# EAGLE board 2017_01_15_release_v2 (EAGLE 7.6.0), part 1 of 2
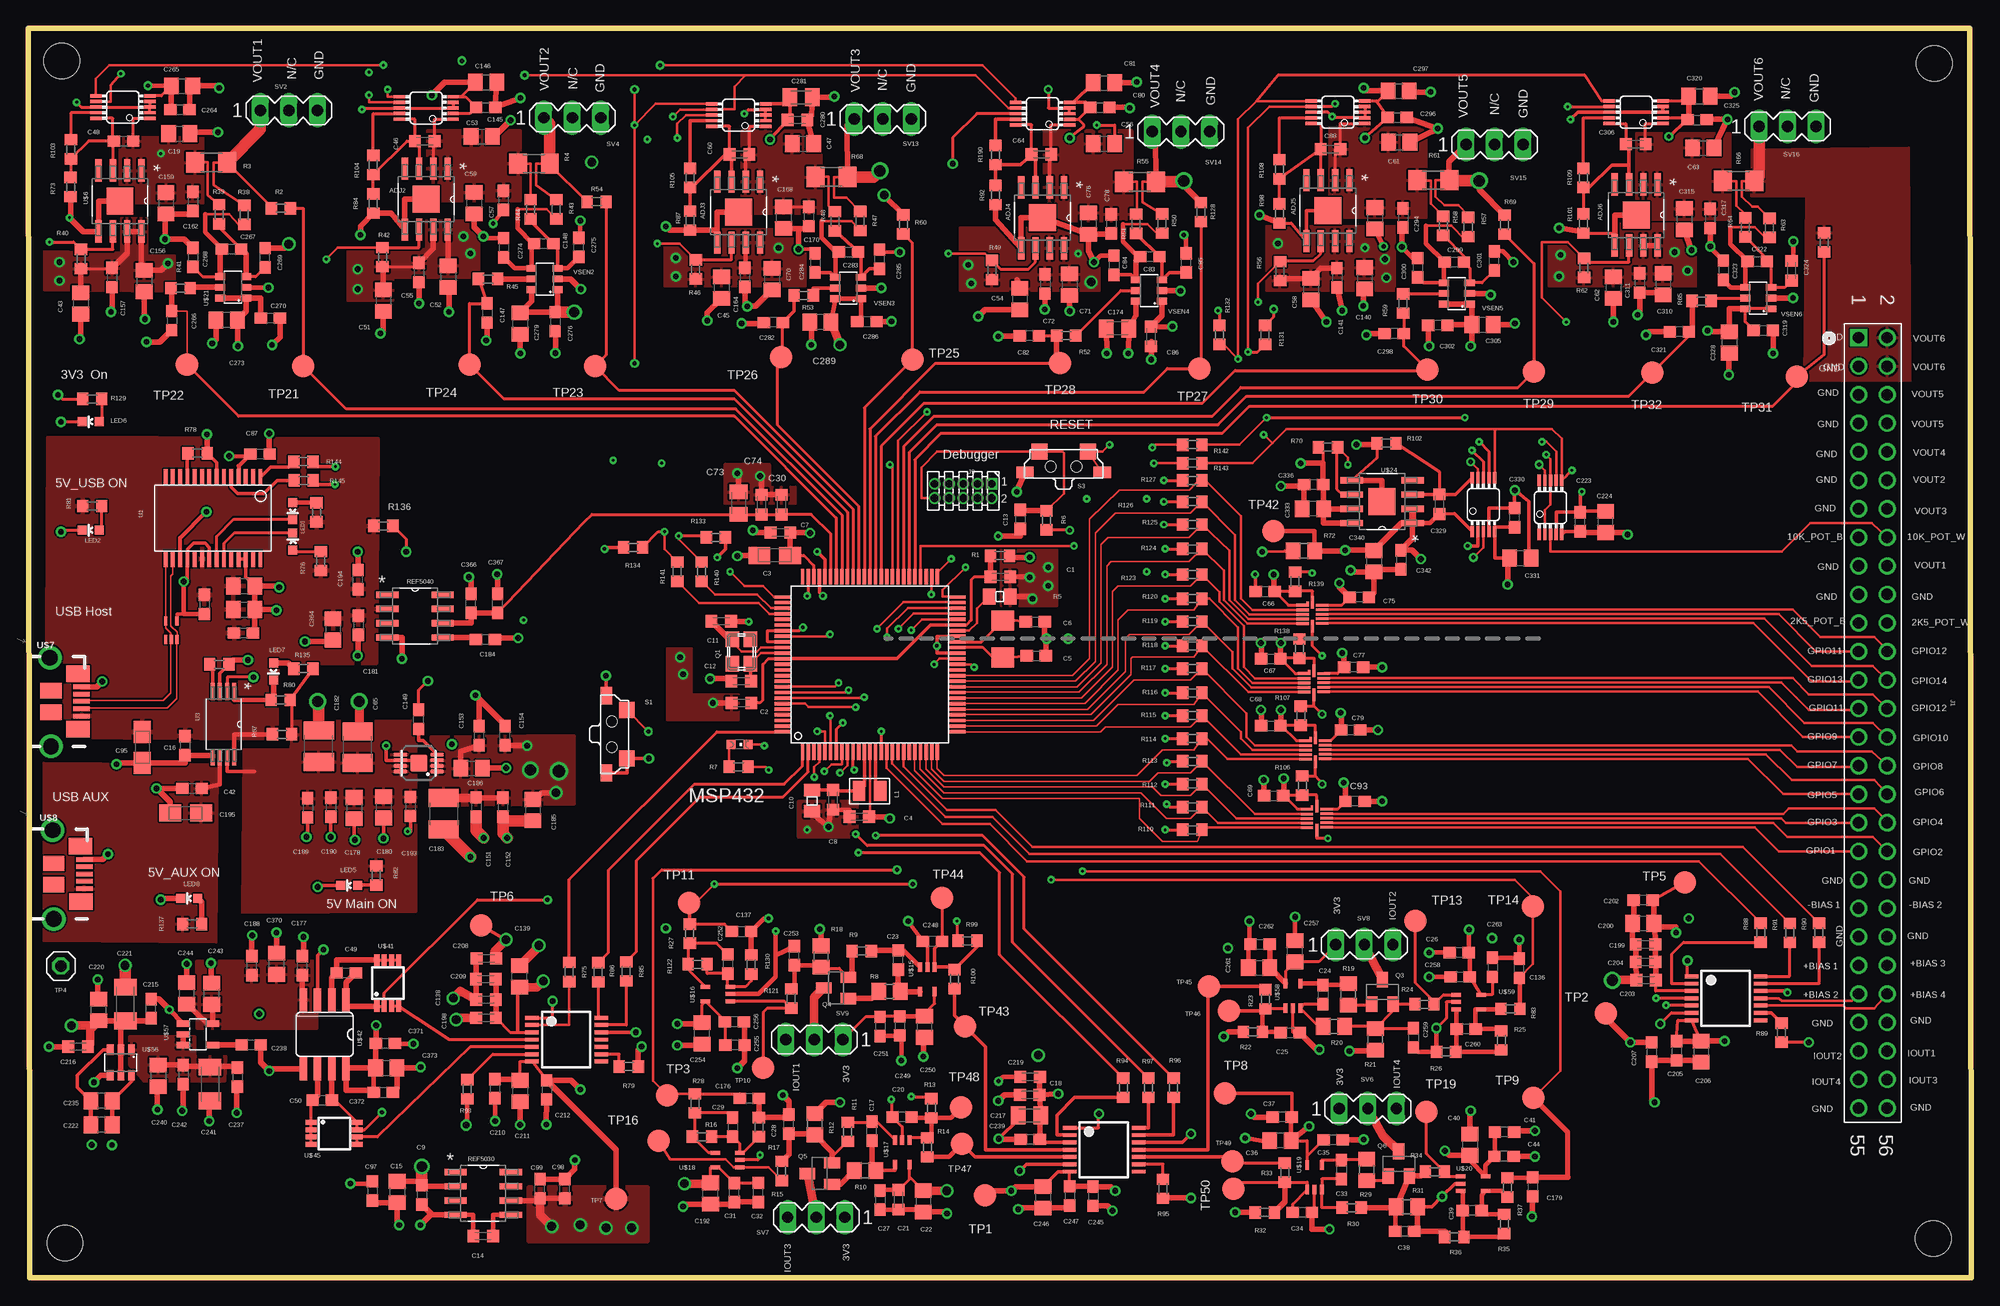
[diagram p21: board, top side]
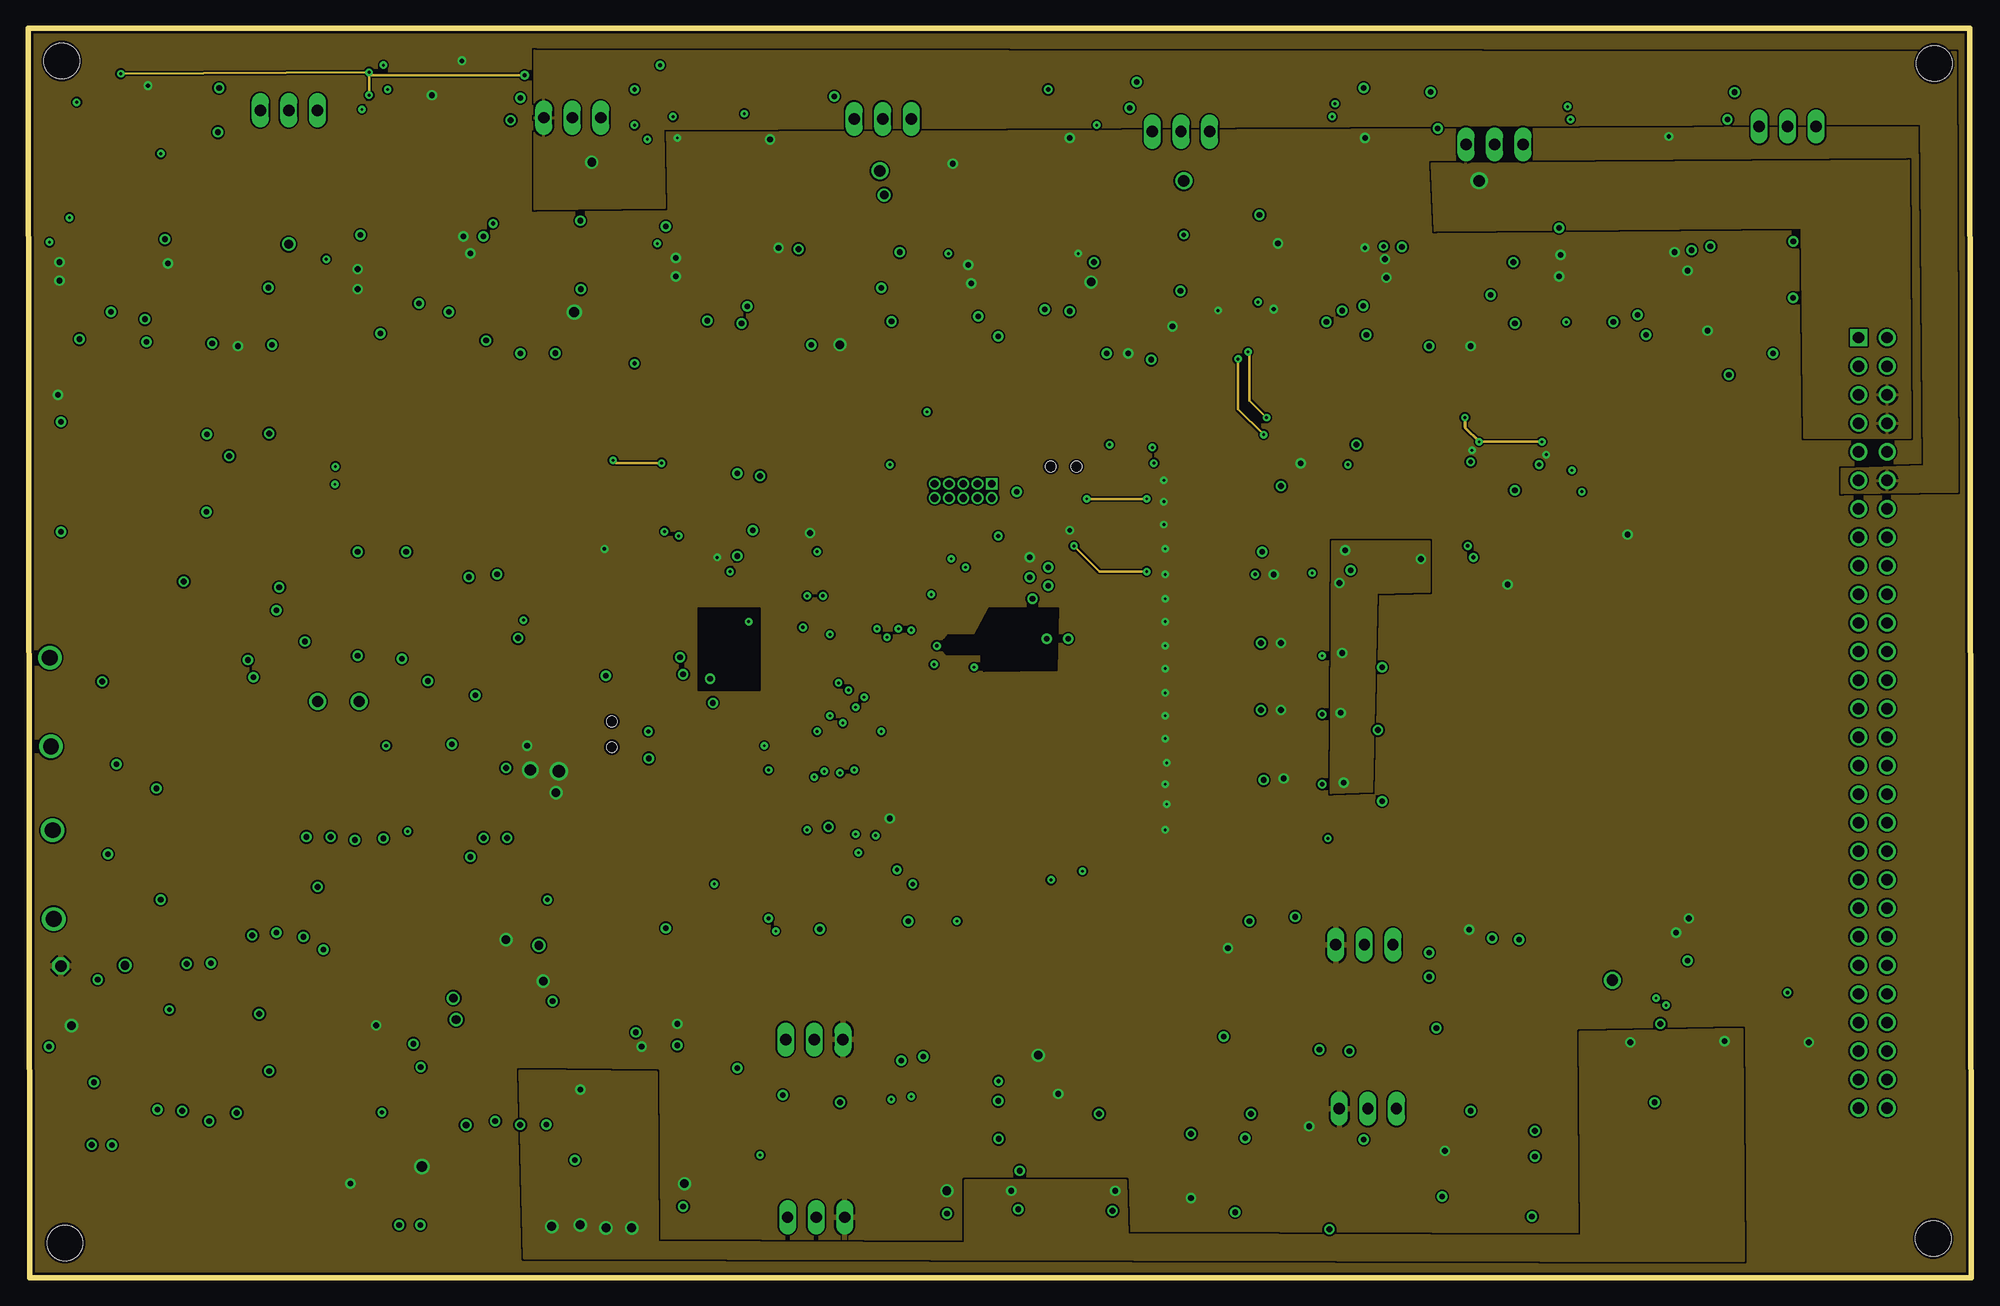
[diagram p22: board, inner layer Mid-Top]
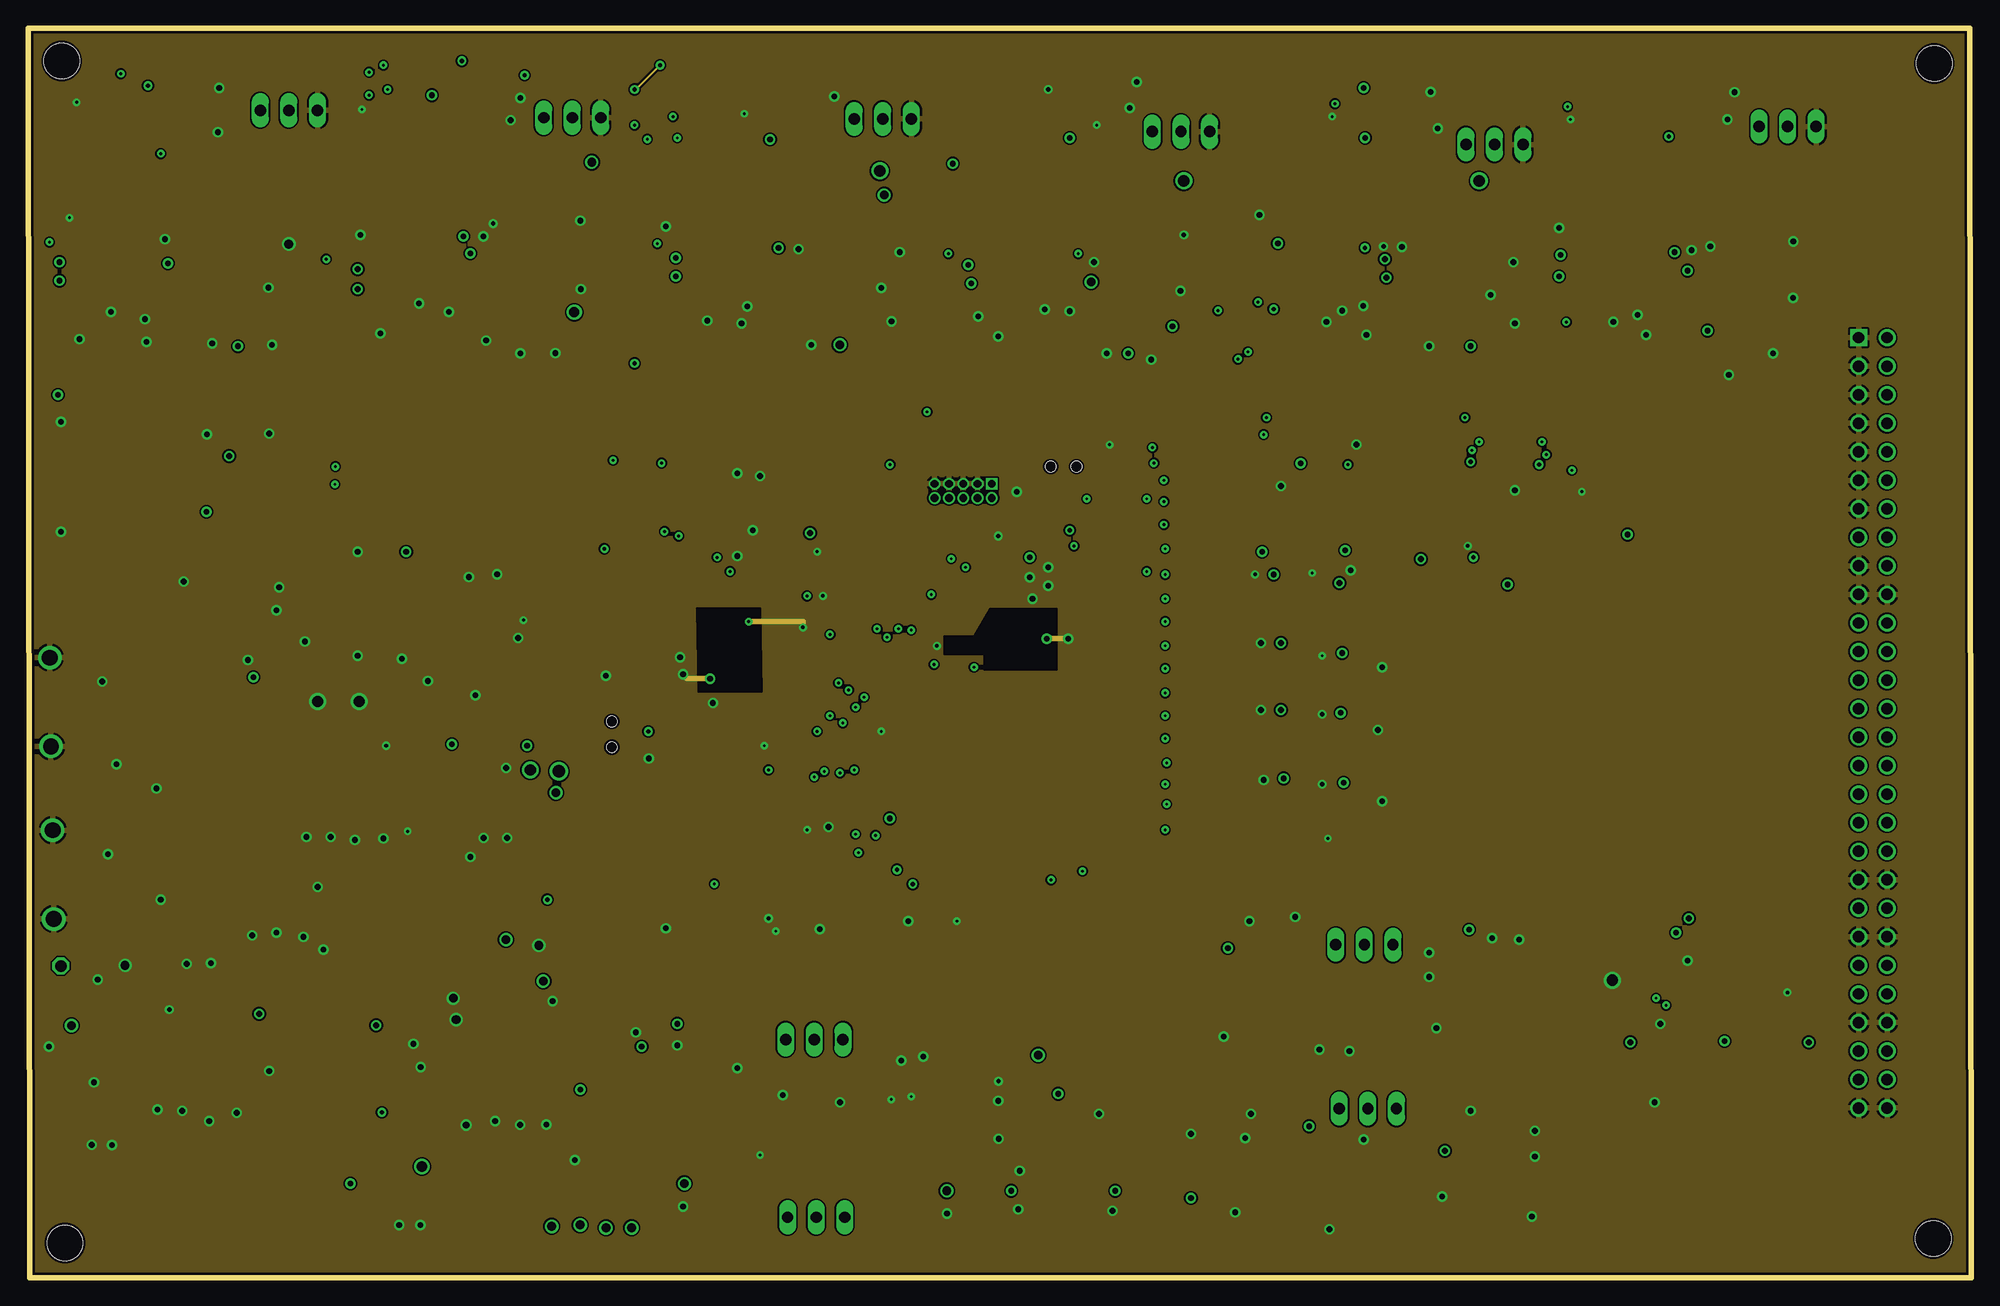
[diagram p23: board, inner layer Mid-Bottom]
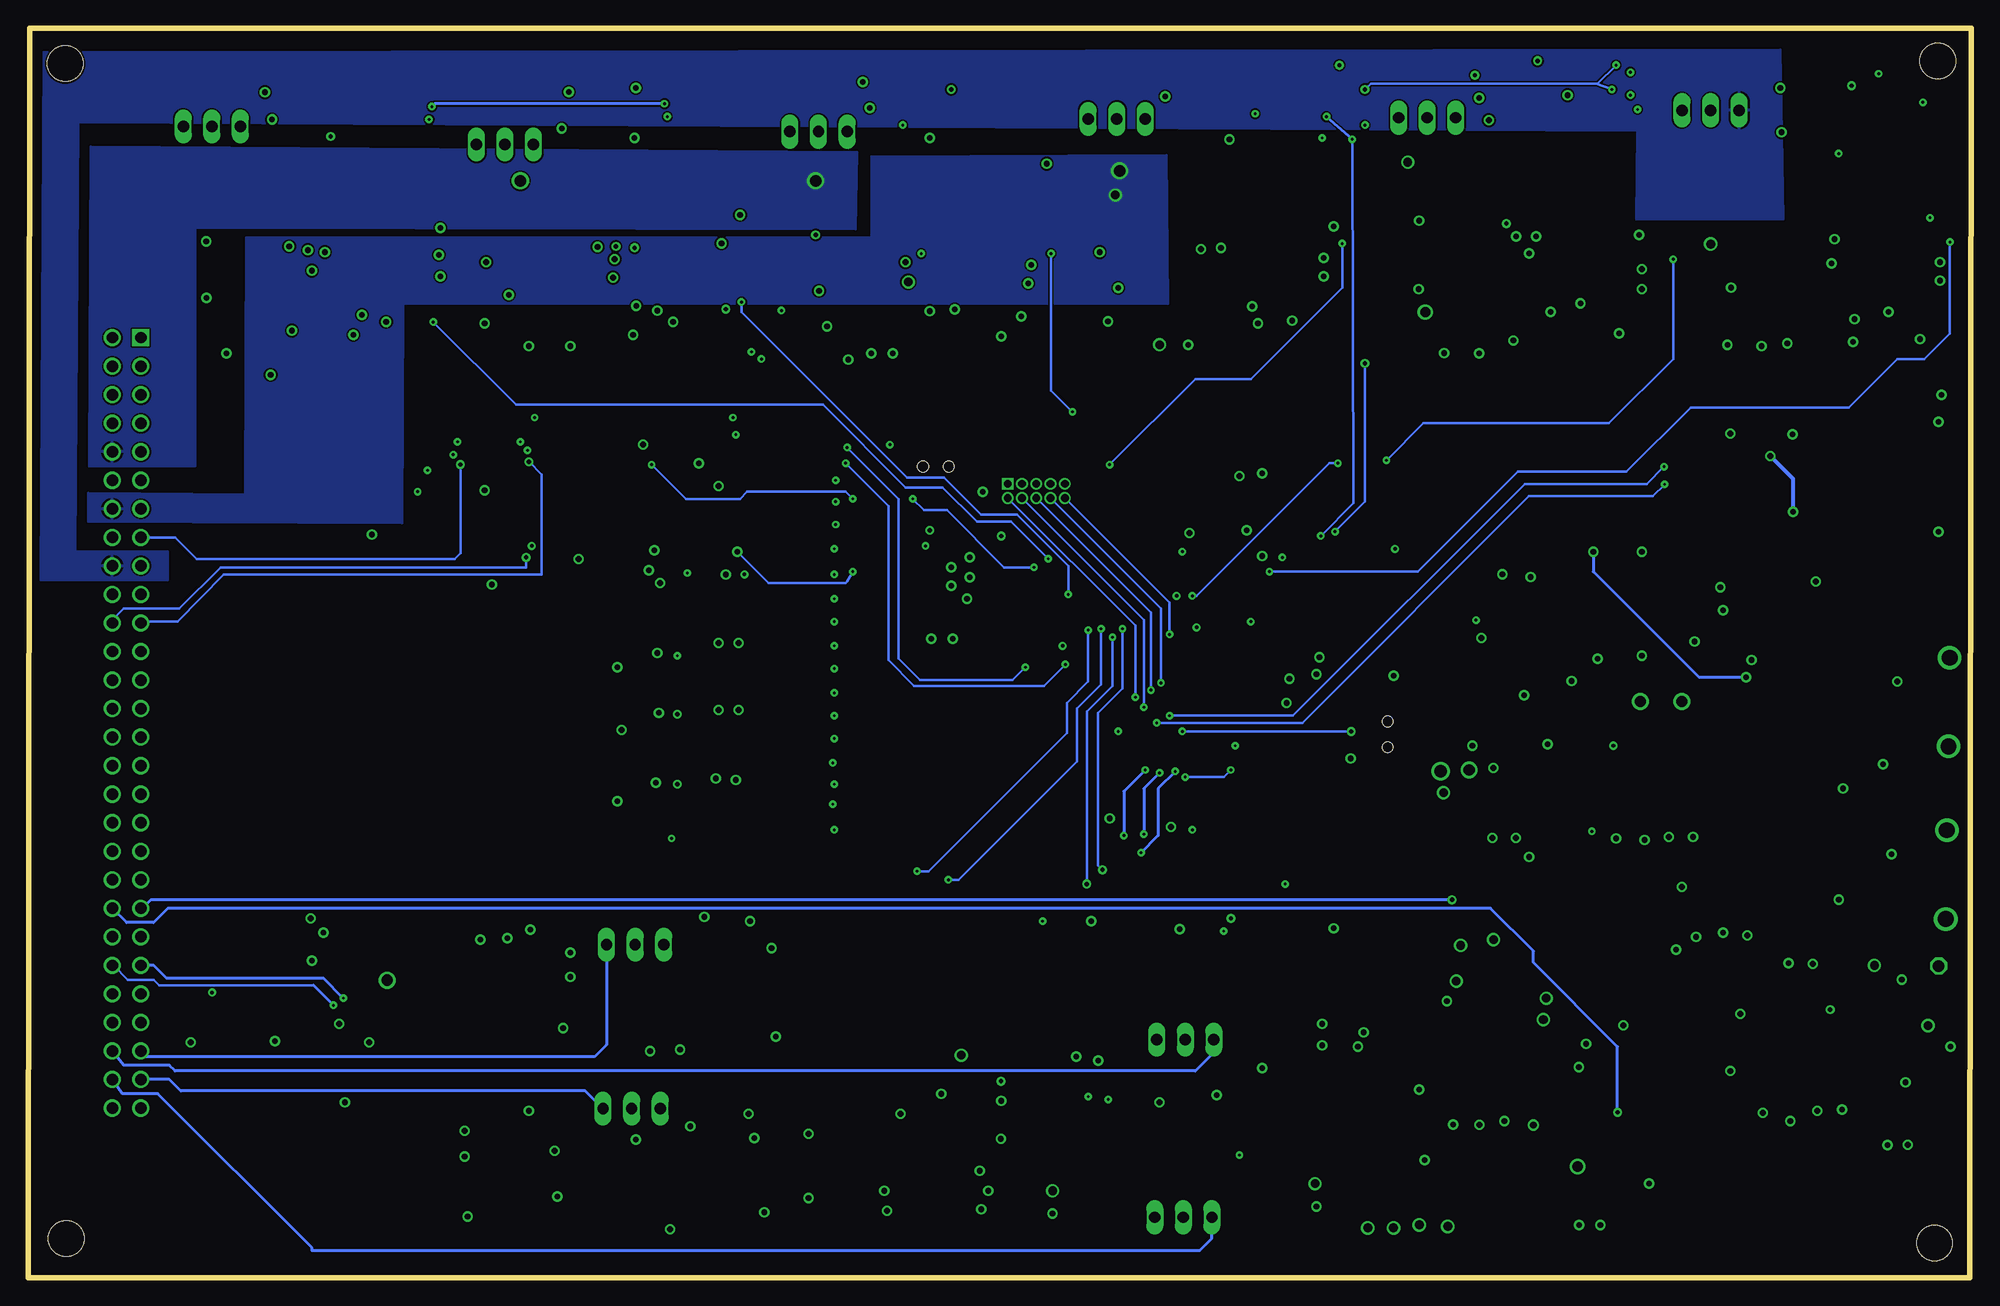
[diagram p24: board, bottom side, seen from below]

Size 172.97 x 111.25 mm. Coordinates in mm from the lower left corner, seen from the top.
Outline: 0.13,0 172.97,0 172.85,111.25 0,111.25 0.13,0
Copper layers (1+2*15+16): Top 0.0178mm / dielectric 12mil / Mid-Top 0.0356mm / dielectric 27mil / Mid-Bottom 0.0356mm / dielectric 12mil / Bottom 0.0178mm
Design rules "MSP430 PCBExpress 4-layer-dietmar_Eddy": minimum track width 6mil, minimum drill 10mil, track to track 6mil, track to pad 6mil, pad to pad 6mil, via to via 8mil, smd to smd 6mil, copper to edge 8mil, drill to drill 8mil, minimum pad ring 0mil, minimum via ring 8mil, stop-mask expansion 5mil, vias tented up to drill 15mil, thermal gap 8mil
Net classes: 0 default: width 0.152 mm, drill 0.254 mm, clearance 0.152 mm; 1 GND: width 0.152 mm, drill 0.254 mm, clearance 0.152 mm to class 0, clearance 0.152 mm; 2 Power: width 0.152 mm, drill 0.254 mm, clearance 0.152 mm to class 0, clearance 0.152 mm to class 1, clearance 0.152 mm

## Footprints (pad centres in the part's own frame; a part is rotated, then mirrored left to right if it is on the bottom)
FC-135_32KHZ = smd 1.8 x 2: P$1 -1.74,0.1; P$2 1.56,0.1
SOIC_8N_PAD = smd 1.981 x 0.559: 1 -2.714,1.905; 2 -2.714,0.635; 3 -2.714,-0.635; 4 -2.714,-1.905; 5 2.714,-1.905; 6 2.714,-0.635; 7 2.714,0.635; 8 2.714,1.905 | smd 2.4 x 2.4: 9 0,0
C0603K = smd 1.05 x 1.08: 1 -0.875,0; 2 0.875,0
A/3216-18R = smd 1.95 x 1.5: + 1.375,0; - -1.375,0
C0603 = smd 1.1 x 1: 1 -0.85,0; 2 0.85,0
CSMD0805 = smd 1.092 x 1.397: 1 -0.94,0; 2 0.94,0
C0805 = smd 1.3 x 1.5: 1 -0.95,0; 2 0.95,0
C1210 = smd 1.6 x 2.7: 1 -1.4,0; 2 1.4,0
C0805K = smd 1.3 x 1.6: 1 -1,0; 2 1,0
C1206K = smd 1.5 x 2: 1 -1.5,0; 2 1.5,0
SOT_DRL_N5 = smd 0.3 x 0.8: 1 -0.5,-0.8; 2 0,-0.8; 3 0.5,-0.8; 4 0.5,0.85; 5 -0.5,0.85
SAMTEC_TSW-128-07-L-D = drill 1.016 square: 1 -68.58,-2.54 | drill 1.016: 2 -68.58,0; 3 -66.04,-2.54; 4 -66.04,0; 5 -63.5,-2.54; 6 -63.5,0; 7 -60.96,-2.54; 8 -60.96,0; 9 -58.42,-2.54; 10 -58.42,0; 11 -55.88,-2.54; 12 -55.88,0; 13 -53.34,-2.54; 14 -53.34,0; 15 -50.8,-2.54; 16 -50.8,0; 17 -48.26,-2.54; 18 -48.26,0; 19 -45.72,-2.54; 20 -45.72,0; 21 -43.18,-2.54; 22 -43.18,0; 23 -40.64,-2.54; 24 -40.64,0; 25 -38.1,-2.54; 26 -38.1,0; 27 -35.56,-2.54; 28 -35.56,0; 29 -33.02,-2.54; 30 -33.02,0; 31 -30.48,-2.54; 32 -30.48,0; 33 -27.94,-2.54; 34 -27.94,0; 35 -25.4,-2.54; 36 -25.4,0; 37 -22.86,-2.54; 38 -22.86,0; 39 -20.32,-2.54; 40 -20.32,0; 41 -17.78,-2.54; 42 -17.78,0; 43 -15.24,-2.54; 44 -15.24,0; 45 -12.7,-2.54; 46 -12.7,0; 47 -10.16,-2.54; 48 -10.16,0; 49 -7.62,-2.54; 50 -7.62,0; 51 -5.08,-2.54; 52 -5.08,0; 53 -2.54,-2.54; 54 -2.54,0; 55 0,-2.54; 56 0,0
ARM-10 = drill 0.7 pad 0.95 square: 1 -2.54,-0.635 | drill 0.7 pad 0.95: 2 -2.54,0.635; 3 -1.27,-0.635; 4 -1.27,0.635; 5 0,-0.635; 6 0,0.635; 7 1.27,-0.635; 8 1.27,0.635; 9 2.54,-0.635; 10 2.54,0.635
0806 = smd 1.1 x 1.8: 1 -0.94,0; 2 0.94,0
CHIPLED_0603 = smd 0.8 x 0.8: A 0,-0.75; C 0,0.75
LED-0603 = smd 0.8 x 0.8: A 0,-0.75; C 0,0.75
LQFP100 = smd 1.4 x 0.3: 1 -7.8,6; 2 -7.8,5.5; 3 -7.8,5; 4 -7.8,4.5; 5 -7.8,4; 6 -7.8,3.5; 7 -7.8,3; 8 -7.8,2.5; 9 -7.8,2; 10 -7.8,1.5; 11 -7.8,1; 12 -7.8,0.5; 13 -7.8,0; 14 -7.8,-0.5; 15 -7.8,-1; 16 -7.8,-1.5; 17 -7.8,-2; 18 -7.8,-2.5; 19 -7.8,-3; 20 -7.8,-3.5; 21 -7.8,-4; 22 -7.8,-4.5; 23 -7.8,-5; 24 -7.8,-5.5; 25 -7.8,-6; 51 7.8,-6; 52 7.8,-5.5; 53 7.8,-5; 54 7.8,-4.5; 55 7.8,-4; 56 7.8,-3.5; 57 7.8,-3; 58 7.8,-2.5; 59 7.8,-2; 60 7.8,-1.5; 61 7.8,-1; 62 7.8,-0.5; 63 7.8,0; 64 7.8,0.5; 65 7.8,1; 66 7.8,1.5; 67 7.8,2; 68 7.8,2.5; 69 7.8,3; 70 7.8,3.5; 71 7.8,4; 72 7.8,4.5; 73 7.8,5; 74 7.8,5.5; 75 7.8,6 | smd 0.3 x 1.4: 26 -6,-7.8; 27 -5.5,-7.8; 28 -5,-7.8; 29 -4.5,-7.8; 30 -4,-7.8; 31 -3.5,-7.8; 32 -3,-7.8; 33 -2.5,-7.8; 34 -2,-7.8; 35 -1.5,-7.8; 36 -1,-7.8; 37 -0.5,-7.8; 38 0,-7.8; 39 0.5,-7.8; 40 1,-7.8; 41 1.5,-7.8; 42 2,-7.8; 43 2.5,-7.8; 44 3,-7.8; 45 3.5,-7.8; 46 4,-7.8; 47 4.5,-7.8; 48 5,-7.8; 49 5.5,-7.8; 50 6,-7.8; 76 6,7.8; 77 5.5,7.8; 78 5,7.8; 79 4.5,7.8; 80 4,7.8; 81 3.5,7.8; 82 3,7.8; 83 2.5,7.8; 84 2,7.8; 85 1.5,7.8; 86 1,7.8; 87 0.5,7.8; 88 0,7.8; 89 -0.5,7.8; 90 -1,7.8; 91 -1.5,7.8; 92 -2,7.8; 93 -2.5,7.8; 94 -3,7.8; 95 -3.5,7.8; 96 -4,7.8; 97 -4.5,7.8; 98 -5,7.8; 99 -5.5,7.8; 100 -6,7.8
MSOP10 = smd 0.3 x 1.02: 1 -1,-2.4; 2 -0.5,-2.4; 3 0,-2.4; 4 0.5,-2.4; 5 1,-2.4; 6 1,2.4; 7 0.5,2.4; 8 0,2.4; 9 -0.5,2.4; 10 -1,2.4
FA-238 = smd 1.4 x 1.2: 1 -1.1,-0.8; 2 1.1,-0.8; 3 1.1,0.8; 4 -1.1,0.8
SOT23-BEC = smd 1 x 1.4: B -0.95,-1.1; C 0,1.1; E 0.95,-1.1
R0603 = smd 1 x 1.1: 1 -0.85,0; 2 0.85,0
R1206 = smd 1.6 x 1.803: 1 -1.422,0; 2 1.422,0
0805 = smd 1.092 x 1.397: 1 -0.94,0; 2 0.94,0
R0805 = smd 1.3 x 1.5: 1 -0.95,0; 2 0.95,0
SOIC127P600X175-8N = smd 1.981 x 0.559: 1 -2.464,1.905; 2 -2.464,0.635; 3 -2.464,-0.635; 4 -2.464,-1.905; 5 2.464,-1.905; 6 2.464,-0.635; 7 2.464,0.635; 8 2.464,1.905
TS-1188E = smd 1.524 x 1.016: G1 -3.429,-0.508; G2 3.429,-0.508 | smd 1.397 x 1.397: S1 -2.159,1.333; S2 2.159,1.333 | hole 0.95: -1.15,0; 1.15,0
MA03-1 = drill 1.016 long: 1 -2.54,0; 2 0,0; 3 2.54,0
TP20R = smd 2 x 2: TP 0,0
1X01 = drill 1.016 octagon: 1 0,0
SSOP28DB = smd 0.348 x 1.397: 1 -4.225,-3.656; 2 -3.575,-3.656; 3 -2.925,-3.656; 4 -2.275,-3.656; 5 -1.625,-3.656; 6 -0.975,-3.656; 7 -0.325,-3.656; 8 0.325,-3.656; 9 0.975,-3.656; 10 1.625,-3.656; 11 2.275,-3.656; 12 2.925,-3.656; 13 3.575,-3.656; 14 4.225,-3.656; 15 4.225,3.656; 16 3.575,3.656; 17 2.925,3.656; 18 2.275,3.656; 19 1.625,3.656; 20 0.975,3.656; 21 0.325,3.656; 22 -0.325,3.656; 23 -0.975,3.656; 24 -1.625,3.656; 25 -2.275,3.656; 26 -2.925,3.656; 27 -3.575,3.656; 28 -4.225,3.656
SOP65P640X120-8N = smd 1.473 x 0.356: 1 -2.921,0.965; 2 -2.921,0.33; 3 -2.921,-0.33; 4 -2.921,-0.965; 5 2.921,-0.965; 6 2.921,-0.33; 7 2.921,0.33; 8 2.921,0.965
MOUNTHOLE_125MIL = hole 3.175: 0,0
USB_MICRO_EDDY = smd 1.45 x 0.4: D+ 2.725,0; D-- 2.725,-0.65; GND 2.725,1.3; ID 2.725,0.65; VBUS_ 2.725,-1.3 | drill 1.4: SHIELD1 -0.1,3.9; SHILD2 0,-4 | smd 1.9 x 1.375: SHIELD3 0,0.95; SHIELD4 0,-0.95 | smd 2.1 x 1.475: SHIELD5 2.394,2.469; SHIELD6 2.417,-2.469
UQFN-12(RUT-12) = smd 0.25 x 1.1: A1 -0.38,-0.85; A2 0.02,-0.85; A3 0.42,-0.85; A4 0.82,-0.85; B1 -0.42,0.9; B2 -0.02,0.9; B3 0.38,0.9; B4 0.78,0.9; VCCA -0.83,-0.85; VCCB -0.82,0.9 | smd 1.1 x 0.25: GND 1.05,0.03; OE -1.09,0.03 | smd 0.3 x 0.2: NC -0.99,-0.4
TSSOP14 = smd 0.35 x 1.2: 1 -1.95,-3.025; 2 -1.3,-3.025; 3 -0.65,-3.025; 4 0,-3.025; 5 0.65,-3.025; 6 1.3,-3.025; 7 1.95,-3.025; 8 1.95,3.125; 9 1.3,3.125; 10 0.65,3.125; 11 0,3.125; 12 -0.65,3.125; 13 -1.3,3.125; 14 -1.95,3.125
SC70 = smd 0.35 x 0.85: 1 -1.6,-1.3; 2 -0.95,-1.3; 3 -0.3,-1.3; 4 -0.3,0.9; 5 -1.6,0.9
SOT23-6 = smd 0.6 x 0.9: 1 -0.95,-1.15; 2 0,-1.15; 3 0.95,-1.15; 4 0.95,1.15; 5 0,1.15; 6 -0.95,1.15
MSOP8 = smd 0.45 x 1: 1 -0.975,-2.05; 2 -0.325,-2.05; 3 0.325,-2.05; 4 0.975,-2.05; 5 0.975,2.05; 6 0.325,2.05; 7 -0.325,2.05; 8 -0.975,2.05
SO08 = smd 0.66 x 2.032: 1 -1.905,-3.073; 2 -0.635,-3.073; 3 0.635,-3.073; 4 1.905,-3.073; 5 1.905,3.073; 6 0.635,3.073; 7 -0.635,3.073; 8 -1.905,3.073
LFCSP8 = smd 1.2 x 0.32: 1 -1.625,0.75; 2 -1.625,0.25; 3 -1.625,-0.25; 4 -1.625,-0.75; 5 1.625,-0.75; 6 1.625,-0.25; 7 1.625,0.25; 8 1.625,0.75 | smd 1.5 x 1.5: EXP 0,0
SOT23-5 = smd 0.55 x 1.2: 1 -0.95,-1.3; 2 0,-1.3; 3 0.95,-1.3; 4 0.95,1.3; 5 -0.95,1.3

## Placement (x,y rotation side)
32KHZ  FC-135  [FC-135_32KHZ]  86.66,56.77 270 top
ADJ2  LP38511_SOIC  [SOIC_8N_PAD]  35.43,96.01 270 top
ADJ3  LP38511_SOIC  [SOIC_8N_PAD]  63.25,94.87 270 top
ADJ4  LP38511_SOIC  [SOIC_8N_PAD]  90.3,94.36 270 top
ADJ5  LP38511_SOIC  [SOIC_8N_PAD]  115.7,95 270 top
ADJ6  LP38511_SOIC  [SOIC_8N_PAD]  143.13,94.61 270 top
C1  0.1u  [C0603K]  86.54,62.41 0 top
C2  0.1u  [C0603K]  63.5,51.18 180 top
C3  10u  [A/3216-18R]  66.46,64.3 0 top
C4  0.1u  [C0603K]  73.99,41.05 180 top
C5  22p  [C0603]  89.74,55.37 0 top
C6  22p  [C0603]  89.64,58.39 0 top
C7  0.1u  [C0603K]  66.97,66.33 180 top
C8  100n  [C0603K]  71.65,42.55 270 top
C9  1u  [C0603]  35.04,7.38 270 top
C10  4u7  [CSMD0805]  69.79,42.47 270 top
C11  22p  [C0603K]  61.7,58.45 0 top
C12  22p  [C0603K]  63.47,53.11 180 top
C13  1n  [C0603]  88.32,67.51 270 top
C14  1u  [C0603K]  40.51,3.72 180 top
C15  10u  [C0805]  32.86,7.64 270 top
C16  0.1u  [C0603]  13.97,47.37 270 top
C17  10n  [C0603]  75.11,13.07 90 top
C18  0.1u  [C0603K]  89.16,16.28 180 top
C19  22u  [C0805]  13.46,101.85 0 top
C20  100p  [C0603]  77.79,14.3 180 top
C21  0.1u  [C0603K]  77.49,6.95 270 top
C22  10u  [C0805]  79.68,6.82 270 top
C23  10n  [C0603]  77.45,28.29 90 top
C24  10n  [C0603]  115.24,25.2 270 top
C25  100p  [C0603]  112.34,21.82 0 top
C26  0.1u  [C0603]  127.38,28.95 180 top
C27  1u  [C0603]  75.84,6.92 270 top
C28  10n  [C0603]  67.72,13.68 90 top
C29  0.1u  [C0603]  62.71,13.42 270 top
C30  0.1u  [C0603K]  67.06,68.83 90 top
C31  1u  [C0603]  62.87,7.58 90 top
C32  0.1u  [C0603]  65,7.61 90 top
C33  10n  [C0603]  116.89,9.65 270 top
C34  100p  [C0603]  113.42,5.84 0 top
C35  0.1u  [C0603]  116.16,12.29 0 top
C36  10u  [C0805]  111.47,12.22 180 top
C37  1u  [C0603]  111.63,14.3 180 top
C38  10n  [C0603]  122.54,4.14 0 top
C39  0.1u  [C0603]  128.54,5.99 180 top
C40  10u  [C0805]  128.32,11.86 270 top
C41  1u  [C0603]  131.41,12.98 180 top
C42  0.1u  [C0603]  14.61,43.56 0 top
C43  10u  [C0805]  4.7,86.74 270 top
C44  0.1u  [C0603]  131.36,10.82 180 top
C45  10u  [C0805]  61.72,88.14 270 top
C46  3.3n  [C0603K]  35.31,101.2 180 top
C47  22u  [C0805]  68.96,100.97 0 top
C48  3.3n  [C0603]  8.5,101.18 180 top
C49  0.1u  [C0603]  28.32,27.15 0 top
C50  0.1u  [C0603]  26.18,15.82 0 top
C51  10u  [C0805]  31.62,87 270 top
C52  10u  [C0805]  37.38,89.13 270 top
C53  22u  [C0805]  40.39,101.6 0 top
C54  10u  [C0805]  88.27,87.12 270 top
C55  0.1u  [C0603]  34.79,89.49 270 top
C56  22u  [C0805]  95.76,100.97 0 top
C57  0.1u  [C0603]  42.31,95.92 270 top
C58  10u  [C0805]  114.17,88.01 270 top
C59  10u  [C0805]  39.7,95.66 270 top
C60  3.3n  [C0603K]  63.33,100 180 top
C61  22u  [C0805]  122.05,101.09 0 top
C62  10u  [C0805]  141.1,88.14 270 top
C63  22u  [C0805]  149.1,100.58 0 top
C64  3.3n  [C0603K]  90.19,100 180 top
C65  22u  [C1210]  29.34,47.24 90 top
C66  0.1u  [C0603]  110.11,61.09 0 top
C67  0.1u  [C0603]  110.62,55.12 0 top
C68  0.1u  [C0603]  110.62,49.15 0 top
C69  0.1u  [C0603]  110.87,42.93 0 top
C70  10u  [C0805]  66.22,88.9 270 top
C71  10u  [C0805]  92.68,88.42 270 top
C72  0.1u  [C0603]  90.52,88.47 270 top
C73  10u  [C0805K]  63.25,68.96 90 top
C74  1u  [C0603K]  65.28,68.83 90 top
C75  0.1u  [C0603]  118.49,60.58 180 top
C76  10u  [C0805]  94.38,93.85 270 top
C77  0.1u  [C0603]  117.98,54.36 180 top
C78  0.1u  [C0603]  96.42,93.83 270 top
C79  0.1u  [C0603]  117.73,48.77 180 top
C80  0.1u  [C0603]  95.4,104.19 0 top
C81  10u  [C0805]  95.76,106.37 0 top
C82  2.2n  [C0603]  89.13,83.85 180 top
C83  0.1u  [C0603]  99.85,90.9 0 top
C84  0.1u  [C0603]  96.64,90.14 270 top
C85  0.1u  [C0603]  103.08,90.35 90 top
C86  0.1u  [C0603K]  99.95,83.79 270 top
C87  0.1u  [C0603]  20.65,73.33 0 top
C88  3.3n  [C0603K]  115.93,100.47 180 top
C89  10u  [C0805]  19.23,61.57 0 top
C90  4.7u  [C0805]  19.23,59.49 0 top
C91  0.1u  [C0603]  15.7,59.94 270 top
C92  0.1u  [C0603]  19.18,57.4 0 top
C93  0.1u  [C0603]  118.11,42.42 180 top
C95  4.7u  [A/3216-18R]  10.16,47.22 90 top
C97  0.1u  [C0603]  30.65,7.74 270 top
C98  1u  [C0603]  47.79,7.93 90 top
C99  1u  [C0603]  45.58,7.93 90 top
C136  2.2n  [C0603]  132.74,27.56 90 top
C137  2.2n  [C0603]  63.5,30.83 0 top
C138  0.1u  [C0603K]  40.76,24.76 180 top
C139  10u  [C0805]  43.76,26.83 90 top
C140  10u  [C0805]  118.96,88.98 270 top
C141  0.1u  [C0603]  116.5,89.03 270 top
C145  0.1u  [C0603]  40.74,104.19 0 top
C146  10u  [C0805]  40.76,106.42 0 top
C147  2.2n  [C0603]  40.86,85.88 270 top
C148  0.1u  [C0603]  45.89,92.07 0 top
C149  1n  [C0603]  34.77,49.71 90 top
C151  100p  [C0603]  39.88,41.91 270 top
C152  2.2n  [C0603]  42.27,41.88 270 top
C153  0.1u  [C0603]  40.16,48.26 90 top
C154  0.1u  [C0603]  42.47,48.26 90 top
C156  10u  [C0805]  10.32,88.74 270 top
C157  0.1u  [C0603]  7.48,89.05 270 top
C159  10u  [C0805]  12.28,95.65 270 top
C162  0.1u  [C0603]  14.67,95.83 270 top
C164  0.1u  [C0603]  63.8,89.06 270 top
C168  10u  [C0805]  67.23,94.36 270 top
C170  0.1u  [C0603]  69.49,94.47 270 top
C174  4.7u  [C0805K]  96.98,84.51 180 top
C176  2.2n  [C0603]  64.2,15.97 0 top
C177  1u  [C0603]  24.41,27.78 90 top
C178  10u  [C0805]  29.03,41.81 270 top
C179  2.2n  [C0603]  133.92,8.1 270 top
C180  4.7u  [C0805]  31.65,41.88 270 top
C181  1u  [C0603]  29.4,58.09 270 top
C182  22u  [C1210]  25.88,47.32 90 top
C183  22u  [C1210]  36.98,41.3 270 top
C184  1u  [C0603]  40.69,56.83 0 top
C185  4.7u  [C0805]  44.93,41.63 270 top
C186  4.7u  [C0805]  39.47,45.36 0 top
C188  0.1u  [C0603]  19.92,27.78 90 top
C189  100p  [C0603]  24.89,41.83 270 top
C190  2.2n  [C0603]  26.95,41.88 270 top
C192  10u  [C0805]  60.76,7.5 90 top
C193  0.1u  [C0603]  34.04,41.96 270 top
C194  0.1u  [C0603]  29.38,62.16 90 top
C195  4.7u  [A/3216-18R]  14.02,41.38 0 top
C198  1u  [C0603K]  40.76,23.14 180 top
C199  0.1u  [C0603K]  143.96,29.68 180 top
C200  10u  [C0805]  143.76,31.53 180 top
C202  1u  [C0603]  143.76,33.62 180 top
C203  0.1u  [C0603K]  144.01,26.51 180 top
C204  100p  [C0603K]  143.96,28.13 180 top
C205  0.1u  [C0603]  146.72,20.21 270 top
C206  10u  [C0805]  148.91,20.14 270 top
C207  1u  [C0603]  144.51,20.11 270 top
C208  0.1u  [C0603K]  40.79,28.44 180 top
C209  100p  [C0603K]  40.74,26.59 180 top
C210  0.1u  [C0603]  41.56,16.84 270 top
C211  10u  [C0805]  43.79,16.63 270 top
C212  1u  [C0603]  46.16,16.73 270 top
C215  1u  [C0603]  10.96,23.97 90 top
C216  0.1u  [C0603K]  4.45,20.59 180 top
C217  10u  [C0805K]  89.13,14.45 180 top
C219  0.1u  [C0603K]  89.18,17.88 180 top
C220  10u  [C0805]  6.28,23.84 90 top
C221  22u  [C1206K]  8.65,24.38 90 top
C222  4.7u  [C0805]  6.53,13.63 180 top
C223  0.1u  [C0603]  138.15,67.3 90 top
C224  10u  [C0805]  140.41,67.3 90 top
C235  4.7u  [C0805]  6.53,15.76 180 top
C237  0.1u  [C0603]  18.63,17.86 270 top
C238  10n  [C0603]  19.86,20.74 0 top
C239  100p  [C0603]  89.21,12.32 180 top
C240  10u  [C0805]  11.6,17.99 270 top
C241  22u  [C1206K]  16.19,17.25 270 top
C242  1u  [C0603]  13.81,18.09 270 top
C243  4.7u  [C0805]  16.34,25.29 90 top
C244  4.7u  [C0805]  14.13,25.32 90 top
C245  0.1u  [C0603]  94.79,7.27 270 top
C246  10u  [C0805]  90.32,7.17 270 top
C247  1u  [C0603]  92.71,7.29 270 top
C248  100p  [C0603]  80.49,29.95 180 top
C249  0.1u  [C0603]  77.59,22.43 270 top
C250  10u  [C0805]  79.77,22.35 270 top
C251  1u  [C0603]  75.84,22.38 270 top
C252  0.1u  [C0603]  62.27,27.94 270 top
C253  10n  [C0603]  68.21,28.68 90 top
C254  10u  [C0805]  60,21.77 90 top
C255  1u  [C0603]  62.92,20.71 180 top
C256  0.1u  [C0603]  62.87,22.79 180 top
C257  10u  [C0805]  112.77,29.08 90 top
C258  1u  [C0603]  127.46,26.79 180 top
C259  10n  [C0603]  123.3,21.37 270 top
C260  0.1u  [C0603]  127.99,22.14 180 top
C261  10u  [C0805]  109.57,27.61 0 top
C262  1u  [C0603]  109.65,29.7 0 top
C263  0.1u  [C0603]  130.33,27.64 270 top
C264  0.1u  [C0603]  13.52,104 0 top
C265  10u  [C0805]  13.7,106.11 0 top
C266  2.2n  [C0603]  12.79,85.21 270 top
C267  0.1u  [C0603]  18.12,91.58 0 top
C268  0.1u  [C0603]  14.67,90.85 270 top
C269  0.1u  [C0603]  21.1,90.81 90 top
C270  0.1u  [C0603]  21.57,85.43 0 top
C273  4.7u  [C0805]  17.67,85.26 180 top
C274  0.1u  [C0603]  42.34,91.7 270 top
C275  0.1u  [C0603]  49.03,91.74 90 top
C276  0.1u  [C0603]  46.91,85.12 270 top
C279  4.7u  [C0805]  43.79,84.94 270 top
C280  0.1u  [C0603K]  68.47,103.07 0 top
C281  10u  [C0805K]  68.8,105.08 0 top
C282  2.2n  [C0603]  66.32,85.04 180 top
C283  0.1u  [C0603]  73.02,91.34 0 top
C284  0.1u  [C0603]  70.05,90.35 270 top
C285  0.1u  [C0603]  75.8,90.67 90 top
C286  0.1u  [C0603]  74.67,85.11 0 top
C289  4.7u  [C0805]  70.51,85.07 180 top
C292  10u  [C0805]  119.88,94.31 270 top
C294  0.1u  [C0603]  122.37,94.36 270 top
C296  0.1u  [C0603]  121.87,103.29 0 top
C297  10u  [C0805]  121.99,105.66 0 top
C298  2.2n  [C0603]  121.59,84.06 180 top
C299  0.1u  [C0603]  126.95,90.42 0 top
C300  0.1u  [C0603]  123.69,89.92 270 top
C301  0.1u  [C0603]  130.51,90.52 90 top
C302  0.1u  [C0603]  125.48,84.79 180 top
C305  4.7u  [C0805]  129.46,84.85 0 top
C306  3.3n  [C0603K]  143.09,100.9 180 top
C310  10u  [C0805]  145.53,88.45 270 top
C311  0.1u  [C0603]  143.45,88.55 270 top
C315  10u  [C0805]  147.43,94.24 270 top
C317  0.1u  [C0603]  149.72,94.3 270 top
C319  0.1u  [C0603]  154.45,84.34 0 top
C320  10u  [C0805]  148.76,105.19 0 top
C321  2.2n  [C0603]  146.97,84.21 180 top
C322  0.1u  [C0603]  153.91,90.49 0 top
C323  0.1u  [C0603]  150.89,89.7 270 top
C324  0.1u  [C0603K]  156.96,89.65 90 top
C325  0.1u  [C0603]  148.55,103.09 0 top
C328  4.7u  [C0805]  151.42,83.27 270 top
C329  3.3n  [C0603K]  125.63,68.87 90 top
C330  0.1u  [C0603]  132.31,67.67 90 top
C331  10u  [C0805]  132.83,64.08 0 top
C333  10u  [C0805]  114.37,68.46 180 top
C336  0.1u  [C0603]  114.42,70.61 180 top
C340  10u  [C0805]  119.78,63.8 270 top
C342  0.1u  [C0603]  122.2,63.92 270 top
C364  10u  [C0805]  27.14,57.73 270 top
C366  1u  [C0603]  39.44,60.05 90 top
C367  1u  [C0603]  41.8,60.05 90 top
C370  10u  [C0805]  22.13,27.96 90 top
C371  1u  [C0603]  31.8,20.88 0 top
C372  0.1u  [C0603]  31.62,16.51 0 top
C373  10u  [C0805]  31.89,18.7 0 top
ESD_DIODE  TPD2E2U06  [SOT_DRL_N5]  12.75,57.61 0 top
J1  TSW-128-07-L-D  [SAMTEC_TSW-128-07-L-D]  165.48,15.11 270 top
J9  [ARM-10]  83.24,70.05 180 top
L1  4.7uH  [0806]  74.9,43.33 0 top
LED1  [CHIPLED_0603]  63.32,47.47 270 top
LED2  Red  [LED-0603]  5.59,66.55 90 top
LED3  Red  [LED-0603]  23.57,65.53 0 top
LED4  Green  [LED-0603]  23.55,68.25 180 top
LED5  Red  [LED-0603]  28.57,34.92 90 top
LED6  Red  [LED-0603]  5.59,76.2 90 top
LED7  Green  [LED-0603]  21.84,53.98 180 top
LED8  Red  [LED-0603]  14.35,33.78 90 top
MSP432  [LQFP100]  74.93,54.61 90 top
POT2  AD5248  [MSOP10]  35.43,104.14 90 top
POT3  AD5248  [MSOP10]  63.25,103.5 90 top
POT4  AD5248  [MSOP10]  90.3,103.63 90 top
POT5  AD5248  [MSOP10]  116.59,103.76 90 top
POT6  AD5248  [MSOP10]  143.13,103.76 90 top
Q1  [FA-238]  63.5,55.75 90 top
Q3  SI2304DDS  [SOT23-BEC]  120.54,25.46 0 top
Q4  SI2304DDS  [SOT23-BEC]  71.91,25.81 90 top
Q5  SI2304DDS  [SOT23-BEC]  70.46,9.28 90 top
Q6  SI2304DDS  [SOT23-BEC]  122,10.16 0 top
R1  0R  [R0603]  86.51,64.29 180 top
R2  0  [R0603]  22.5,95.2 0 top
R3  0.68  [R1206]  16.31,99.29 180 top
R4  0.68  [R1206]  45.02,99.19 180 top
R5  91kOhm, 0.1%, 25ppm/C  [0805]  86.49,60.66 0 top
R6  47k  [R0603]  90.65,67.44 270 top
R7  470  [R0603]  63.23,45.49 180 top
R8  200  [R0805]  76.68,25.51 180 top
R9  1.5k  [R0603]  74.19,29.09 180 top
R10  200  [R0805]  74.49,9.55 180 top
R11  1.5k  [R0603]  72.95,12.99 270 top
R12  200  [R0805]  70.03,13.68 270 top
R13  4.99K  [R0603]  80.39,15.1 90 top
R14  45.3K  [R0603]  80.04,11.62 90 top
R15  0  [R0603]  67.08,9.51 90 top
R16  95.3K  [R0603]  59.98,12.57 0 top
R17  4.99K  [R0603]  65.05,13.42 90 top
R18  200  [R0805]  70.58,28.6 270 top
R19  200  [R0805]  117.51,25.23 270 top
R20  1.5k  [R0805]  116.23,22.38 0 top
R21  200  [R0805]  119.91,21.23 90 top
R22  4.99K  [R0603]  109.02,21.89 180 top
R23  45.3K  [R0603]  110.14,24.79 270 top
R24  0  [R0603]  124.29,24.35 180 top
R25  95.3K  [R0603]  131.12,21.14 270 top
R26  4.99K  [R0603]  126.22,20.11 180 top
R27  100  [R0603]  58.9,30.63 270 top
R28  100  [R0603]  59.36,15.53 270 top
R29  200  [R0805]  119.15,9.62 270 top
R30  1.5k  [R0603]  117.81,6.25 0 top
R31  200  [R0805]  122.73,6.32 180 top
R32  4.99K  [R0603]  110.08,5.82 180 top
R33  45.3K  [R0603]  111.86,9.37 270 top
R34  0  [R0603]  125.22,9.45 180 top
R35  95.3K  [R0603]  131.39,4.79 270 top
R36  4.99K  [R0603]  126.94,3.63 180 top
R37  100  [R0603]  131.67,8.05 270 top
R38  100  [R0603]  19.24,94.62 90 top
R39  100  [R0603]  17.01,94.67 90 top
R40  10k  [R0603]  4.71,90.7 270 top
R41  1800  [R0603]  13.57,88.1 0 top
R42  10k  [R0603]  31.54,90.86 270 top
R43  100  [R0603]  47.02,95.12 90 top
R44  100  [R0603]  44.73,95.12 90 top
R45  1800  [R0603]  40.94,88.92 0 top
R46  10k  [R0603]  59.43,89.77 270 top
R47  100  [R0603]  74.07,94.08 90 top
R48  100  [R0603]  71.81,94.05 90 top
R49  10k  [R0603]  85.8,89.71 270 top
R50  100  [R0603]  100.94,93.85 90 top
R51  100  [R0603]  98.63,93.83 90 top
R52  1800  [R0603]  92.41,83.87 0 top
R53  1800  [R0603]  69.03,87.45 0 top
R54  0  [R0603]  50.6,95.78 0 top
R55  0.68  [R1206]  98.96,97.56 180 top
R56  10k  [R0603]  111.45,89.61 270 top
R57  100  [R0603]  128.18,93.55 90 top
R58  100  [R0603]  125.97,93.65 90 top
R59  1800  [R0603]  122.39,86.74 90 top
R60  0  [R0603]  77.9,93.78 90 top
R61  0.16  [R1206]  125.07,97.71 180 top
R62  10k  [R0603]  138.49,89.9 270 top
R63  100  [R0603]  155,93.46 90 top
R64  100  [R0603]  152.85,93.51 90 top
R65  1800  [R0603]  148.96,86.96 0 top
R66  0.16  [R1206]  152.25,97.64 180 top
R67  0  [R0603]  22.61,48.39 180 top
R68  0.68  [R1206]  71.5,97.99 180 top
R69  0  [R0603]  131.42,93.75 90 top
R70  10k  [R0603]  115.71,73.94 180 top
R71  0  [R0603]  159.87,92.18 270 top
R72  0  [R0805]  113.56,64.72 0 top
R73  500  [R0603]  3.78,97.1 270 top
R74  600  [R0603]  17.02,54.61 0 top
R75  0  [R0603]  48.16,27.23 270 top
R76  1k  [R0603]  26.06,63.8 90 top
R77  1k  [R0603]  25.68,68.15 90 top
R78  10k  [R0603]  15.09,73.41 0 top
R79  10K  [R0603]  53.46,18.82 180 top
R80  5k  [R0603]  22.48,51.44 0 top
R81  1k  [R0603]  5.71,68.71 0 top
R82  1k  [R0603]  30.99,35.81 270 top
R83  100  [R0603]  131.93,23.95 180 top
R84  500  [R0603]  30.73,95.63 270 top
R85  0  [R0603]  53.24,27.28 270 top
R86  0  [R0603]  50.75,27.2 270 top
R87  500  [R0603]  58.93,94.11 270 top
R88  0  [R0603]  154.22,30.73 270 top
R89  10K  [R0603]  156.07,21.82 90 top
R90  0  [R0603]  159.4,30.73 270 top
R91  0  [R0603]  156.81,30.7 270 top
R92  500  [R0603]  86.11,96.39 270 top
R93  0  [R0603]  39.09,16.79 90 top
R94  0  [R0603]  97.49,16.92 270 top
R95  10K  [R0603]  101.01,7.92 90 top
R96  0  [R0603]  101.96,16.92 270 top
R97  0  [R0603]  99.72,16.92 270 top
R98  500  [R0603]  111.38,94.74 270 top
R99  4.99K  [R0603]  83.62,30 180 top
R100  45.3K  [R0603]  82.45,26.59 90 top
R101  500  [R0603]  138.43,93.85 270 top
R102  500  [R0603]  120.9,74.3 180 top
R103  0  [R0603]  3.81,100.46 90 top
R104  0  [R0603]  30.73,99.06 90 top
R105  0  [R0603]  58.93,97.92 90 top
R106  10k  [R0603]  113.41,43.81 90 top
R107  10k  [R0603]  113.28,50.04 90 top
R108  0  [R0603]  111.38,98.68 90 top
R109  0  [R0603]  138.43,97.92 90 top
R110  5k  [R0603]  103.63,39.88 0 top
R111  5k  [R0603]  103.63,41.91 0 top
R112  5k  [R0603]  103.63,43.94 0 top
R113  5k  [R0603]  103.63,45.97 0 top
R114  5k  [R0603]  103.63,48.01 0 top
R115  5k  [R0603]  103.63,50.04 0 top
R116  5k  [R0603]  103.63,52.07 0 top
R117  5k  [R0603]  103.63,54.23 0 top
R118  5k  [R0603]  103.63,56.26 0 top
R119  5k  [R0603]  103.63,58.42 0 top
R120  5k  [R0603]  103.63,60.45 0 top
R121  0  [R0603]  67.93,24.87 90 top
R122  95.3K  [R0603]  59.59,27.91 0 top
R123  5k  [R0603]  103.63,62.61 0 top
R124  5k  [R0603]  103.63,64.9 0 top
R125  5k  [R0603]  103.63,67.06 0 top
R126  5k  [R0603]  103.63,69.09 0 top
R127  5k  [R0603]  103.63,70.99 0 top
R128  0  [R0603]  104.39,94.87 90 top
R129  1k  [R0603]  5.71,78.23 0 top
R130  4.99K  [R0603]  64.37,27.89 90 top
R131  5k  [R0603]  110.11,83.95 90 top
R132  5k  [R0603]  106.05,83.95 90 top
R133  5k  [R0603]  61.21,65.91 0 top
R134  5k  [R0603]  53.85,65.02 180 top
R135  5k  [R0603]  24.51,54.23 0 top
R136  5K  [R0603]  31.62,66.93 0 top
R137  1k  [R0603]  14.61,31.5 0 top
R138  10k  [R0603]  113.16,56.01 90 top
R139  10k  [R0603]  112.78,61.98 90 top
R140  0  [R0603]  59.94,62.87 270 top
R141  0  [R0603]  57.79,62.87 270 top
R142  0  [R0603]  103.63,74.17 0 top
R143  0  [R0603]  103.63,72.52 0 top
R144  0  [R0603]  24.51,72.64 0 top
R145  0  [R0603]  24.54,70.99 0 top
R190  0  [R0603]  86.11,99.95 90 top
REF5030  REF5025AID  [SOIC127P600X175-8N]  40.52,7.51 0 top
REF5040  REF5025AID  [SOIC127P600X175-8N]  34.45,58.91 0 top
S1  [TS-1188E]  51.97,48.39 270 top
S3  [TS-1188E]  92.18,72.21 0 top
SV2  [MA03-1]  23.22,103.94 0 top
SV4  [MA03-1]  48.44,103.28 0 top
SV6  [MA03-1]  119.26,15.06 0 top
SV7  [MA03-1]  70.14,5.39 180 top
SV8  [MA03-1]  118.94,29.65 0 top
SV9  [MA03-1]  69.98,21.22 180 top
SV13  [MA03-1]  76.07,103.17 0 top
SV14  [MA03-1]  102.62,102.03 0 top
SV15  [MA03-1]  130.53,100.89 0 top
SV16  [MA03-1]  156.62,102.49 0 top
TP1  TPSQTP20R  [TP20R]  85.19,7.34 180 top
TP2  TPSQTP20R  [TP20R]  140.42,23.53 0 top
TP3  TPSQTP20R  [TP20R]  56.9,16.26 0 top
TP4  TEST_PIN2  [1X01]  2.92,27.76 0 top
TP5  TPSQTP20R  [TP20R]  147.45,35.19 0 top
TP6  TPSQTP20R  [TP20R]  40.31,31.37 0 top
TP7  TPSQTP20R  [TP20R]  52.33,7.04 0 top
TP8  TPSQTP20R  [TP20R]  106.52,16.44 0 top
TP9  TPSQTP20R  [TP20R]  133.99,16 0 top
TP10  TPSQTP20R  [TP20R]  65.43,18.7 180 top
TP11  TPSQTP20R  [TP20R]  58.83,33.39 0 top
TP13  TPSQTP20R  [TP20R]  123.49,31.78 0 top
TP14  TPSQTP20R  [TP20R]  133.96,33.08 0 top
TP16  TPSQTP20R  [TP20R]  56.12,12.19 180 top
TP19  TPSQTP20R  [TP20R]  124.47,14.78 0 top
TP21  TPSQTP20R  [TP20R]  24.5,81.17 180 top
TP22  TPSQTP20R  [TP20R]  14.14,81.3 180 top
TP23  TPSQTP20R  [TP20R]  50.45,81.16 180 top
TP24  TPSQTP20R  [TP20R]  39.3,81.28 180 top
TP25  TPSQTP20R  [TP20R]  78.72,81.74 180 top
TP26  TPSQTP20R  [TP20R]  67.01,81.97 180 top
TP27  TPSQTP20R  [TP20R]  104.27,80.95 180 top
TP28  TPSQTP20R  [TP20R]  91.84,81.41 180 top
TP29  TPSQTP20R  [TP20R]  134.04,80.68 180 top
TP30  TPSQTP20R  [TP20R]  124.54,80.83 180 top
TP31  TPSQTP20R  [TP20R]  157.41,80.23 180 top
TP32  TPSQTP20R  [TP20R]  144.56,80.58 180 top
TP42  TPSQTP20R  [TP20R]  110.85,66.49 0 top
TP43  TPSQTP20R  [TP20R]  83.41,22.38 180 top
TP44  TPSQTP20R  [TP20R]  81.36,33.83 0 top
TP45  TPSQTP20R  [TP20R]  105.1,25.96 0 top
TP46  TPSQTP20R  [TP20R]  106.88,23.78 0 top
TP47  TPSQTP20R  [TP20R]  83.12,11.94 180 top
TP48  TPSQTP20R  [TP20R]  83.04,15.16 0 top
TP49  TPSQTP20R  [TP20R]  107.19,10.36 0 top
TP50  TPSQTP20R  [TP20R]  107.27,7.92 0 top
U1  FT232RLSSOP  [SSOP28DB]  16.46,67.64 180 top
U3  TPS2115AIPWRQ1  [SOP65P640X120-8N]  17.4,49.28 270 top
U$1  MOUNTHOLE_125MIL  [MOUNTHOLE_125MIL]  3.28,3.1 0 top
U$2  MOUNTHOLE_125MIL  [MOUNTHOLE_125MIL]  169.57,3.51 0 top
U$3  MOUNTHOLE_125MIL  [MOUNTHOLE_125MIL]  169.67,108.1 0 top
U$4  AD5248  [MSOP10]  8.43,104.22 90 top
U$5  MOUNTHOLE_125MIL  [MOUNTHOLE_125MIL]  3,108.33 0 top
U$6  LP38511_SOIC  [SOIC_8N_PAD]  8.18,95.86 270 top
U$7  USB_CONN_EDDY  [USB_MICRO_EDDY]  2.03,51.31 0 top
U$8  USB_CONN_EDDY  [USB_MICRO_EDDY]  2.29,35.94 0 top
U$9  TXB0304  [UQFN-12(RUT-12)]  114.68,40.89 270 top
U$10  TXB0304  [UQFN-12(RUT-12)]  114.55,46.99 270 top
U$11  [TSSOP14]  151.09,24.89 270 top
U$12  [TSSOP14]  47.88,21.21 270 top
U$13  AD5248  [MSOP10]  135.51,68.58 0 top
U$14  [TSSOP14]  95.73,11.41 270 top
U$15  OPA333DVT  [SC70]  79.1,26.37 180 top
U$16  OPA333DVT  [SC70]  61.2,26.21 90 top
U$17  OPA333DVT  [SC70]  76.85,10.98 180 top
U$18  OPA333DVT  [SC70]  62.05,11.44 90 top
U$19  OPA333DVT  [SC70]  115.45,9.14 0 top
U$20  OPA333DVT  [SC70]  128.83,7.44 270 top
U$21  MAX44284  [SOT23-6]  18.25,88.17 90 top
U$22  TXB0304  [UQFN-12(RUT-12)]  114.43,52.96 270 top
U$23  TXB0304  [UQFN-12(RUT-12)]  114.3,59.05 270 top
U$24  LP38511_SOIC  [SOIC_8N_PAD]  120.52,69.09 180 top
U$31  AD5248  [MSOP10]  129.54,68.83 0 top
U$41  LT5400  [MSOP8]  32.02,26.24 0 top
U$42  TSZ122  [SO08]  26.4,21.67 180 top
U$43  ADM7171  [LFCSP8]  34.77,45.82 180 top
U$45  LT5400  [MSOP8]  27.25,12.86 270 top
U$56  MAX1697  [SOT23-6]  8.26,19.16 180 top
U$57  TPS723-Q1  [SOT23-5]  15.13,21.67 270 top
U$58  OPA333DVT  [SC70]  113.53,25.3 0 top
U$59  OPA333DVT  [SC70]  128.43,23.6 270 top
VSEN2  MAX44284  [SOT23-6]  45.98,88.92 90 top
VSEN3  MAX44284  [SOT23-6]  73,88.11 90 top
VSEN4  MAX44284  [SOT23-6]  99.77,87.89 90 top
VSEN5  MAX44284  [SOT23-6]  127.16,87.63 90 top
VSEN6  MAX44284  [SOT23-6]  153.99,87.21 90 top

## Tracks (layer width: path | path; a pad name or v marks a point on that pad's centre or on a via)
3V0_REF_TI_ADC  (via drill 0.51, 0.8)
  Top 0.254: C205.1 146.85,22.94 U$11.7 C206.1 | 43.79,17.69 43.79,19.25 U$12.7 C212.1 | C247.1 U$14.7
  Top 0.305: C246.1 91.67,9.46 U$14.7
  Top 0.508: REF5030.6 45.58,6.87 C99.1 C98.1 | C210.1 43.79,17.69 C211.1 | C247.1 94.79,8.14 C245.1 96.4,8.12 v96.77,7.75 | TP7.TP 52.33,11.41 C212.1 48.33,17.59 v49.15,16.76 | C246.1 87.87,8.12 v87.5,7.75 85.6,7.75 TP1.TP | 148.84,21.08 148.72,21.21 148.97,21.21 148.84,21.08 | 148.84,21.08 148.84,20.95 | TP2.TP 140.42,23.16 v142.62,20.95 142.63,20.96 C207.1 | 148.84,21.08 148.83,21.06 C205.1 | 148.84,21.08 v151,21.08
  Top 0.762: v46.61,4.57 45.58,5.6 C99.1
  other vias: 49.15,4.7 51.44,4.45 53.72,4.45
  pour Mid-Top: 43.82,18.41 44.2,1.78 152.65,1.52 152.53,22.1 138.18,21.84 138.3,3.68 97.79,3.81 97.66,8.64 83.44,8.64 83.44,3.05 56.01,3.17 55.88,18.29
  pour Top: 44.58,8 44.58,3.3 55.12,3.3 55.12,8
3V3  (via drill 0.25, 0.3, 0.38, 0.51, 0.76, 0.9, 1, 1.1)
  Top 0.152: U$6.8 9.88,93.19 9.88,92.63
  Top 0.203: 74.91,41.09 C4.1 arc90 74.93,41.11 MSP432.13 | 43.76,21.86 U$12.3 | v135.13,73.28 135.51,72.9 U$13.8 135.51,68.83 135.01,68.33 U$13.2 | v57.79,101.47 57.79,102.74 58.55,103.5 POT3.8
  Top 0.254: 144.86,26.3 C203.1 144.86,25.54 U$11.3 | REF5030.2 38.06,8.1 | 90.06,12.06 C239.1 | C250.1 79.77,23.51 80.7,24.43 U$15.5 | C157.1 7.48,89.85 R40.2 4.83,89.85 | C265.1 11.86,105.22 U$4.5 | 34.79,90.27 C55.1 34.47,90.01 R42.2 | POT2.2 39.34,103.64 C145.1 38.93,105.14 POT2.5 38.53,105.14 C146.1 | C198.1 42.89,21.86 43.56,21.86 U$12.3 | TP5.TP C202.1 | C254.2 60,24.32 U$16.5 61.69,23.21 61.69,23.11 C256.2 62.07,22.74 C255.2 | C22.1 78.45,9 | 78.45,9 U$17.5 | C21.1 78.45,8.75 78.45,9 | C192.2 60.76,9.84 U$18.5 61.46,9.84 C31.2 64.98,8.43 | C261.2 | U$58.5 111.93,27.29 C257.1 114.89,28.13 SV8.1 | SV9.1 74.53,23.23 C251.1 75.43,23.28 C249.1 | C263.2 130.33,25.2 U$59.5 C258.1 | C36.1 113.85,12.22 U$19.5 113.85,10.83 C35.1 | C297.1 120.15,104.76 120.02,104.76 | 120.02,104.76 POT5.5 119.55,104.76 | C320.1 147.81,104.76 POT6.5 | C319.1 152.84,85.1 VSEN6.6 VSEN6.1 | POT6.2 147.7,103.26 C325.1 | v2.67,78.61 3.05,78.23 R129.1 | C3.+ 69.05,64.3 69.93,63.42 MSP432.73 69.9,62.44 | v128.52,73.66 129.54,72.64 U$31.8 | v92.71,66.55 92.71,66.59 R6.2 | TP6.TP v42.55,30.1 | v158.5,20.95 156.07,20.95 | v101.22,39.88 R110.1 | v101.35,42.16 101.6,41.91 R111.1 | v101.22,43.94 R112.1 | v101.35,45.85 101.47,45.97 R113.1 | v101.22,48.01 R114.1 | v101.22,50.04 R115.1 | v101.22,52.07 R116.1 | v101.22,54.23 R117.1 | v101.22,56.26 R118.1 | v101.22,58.42 R119.1 | v101.22,60.45 R120.1 | v101.22,62.61 R123.1 | v101.22,64.9 R124.1 | v101.09,67.06 R125.1 | v101.09,69.09 R126.1 | v101.09,70.99 R127.1 | R70.2 115.27,73.54 115.27,72.52 | 93.5,103.13 POT4.2 | 93.5,103.13 C80.1 | 120.02,104.76 C296.1 v119,101.47 | C281.1 67.8,104.5 | v92.71,101.47 93.98,102.49 93.98,102.65 93.5,103.13
  Top 0.254: POT4.8 84.45,103.63 82.3,101.47 v82.3,99.19 | 111.76,42.93 112.96,41.72 U$9.VCCA | C69.2 113.37,42.93 arc90 R106.1 114.71,42.97 U$9.OE | 111.51,49.19 112.87,47.82 U$10.VCCA | C68.2 113.24,49.15 R107.1 114.58,49.19 U$10.OE | U$22.VCCA 112.8,53.79 C67.2 111.47,55.16 R138.1 114.46,55.16 U$22.OE | U$23.OE 114.33,61.13 R139.1 112.74,61.09 C66.2 112.16,59.88 U$23.VCCA | R131.2 110.87,85.56 v110.87,86.23 | v105.92,86.11 106.05,85.98 R132.2
  Top 0.305: TP8.TP 112.48,16.43 C37.1 | C239.1 90.32,12.06 U$14.3 | C81.1 93.07,104.63 POT4.5 94.11,104.63 C80.1 | v146.05,101.6 C325.1 | C139.1 arc90 43.56,25.68 43.56,21.86 | C331.1 130.54,64.08 U$31.5 130.54,66.83 C330.1 | U$13.5 136.78,66.45 C223.1 | 53,64.9 R134.2 51.44,65.02 v51.31,64.9 | v61.34,64.14 62.06,64.86 R133.2 | v66.04,101.35 C280.1 67.8,103.07 C281.1 | 67.8,104.5 POT3.5
  Top 0.33: U$43.3 U$43.2
  Top 0.406: C250.1 79.77,23.28 C249.1 | C40.2 128.32,10.44 U$20.5 129.73,10.04 C44.2 130.56,10.82 C41.2 | C258.1 128.31,28.88 arc90 C26.1 128.24,30.95 arc-90 v128.27,30.99 | C164.1 63.88,89.98 ADJ3.7 | C224.1 140.31,66.45 | C372.1 30.77,18.59 | v28.7,8.38 30.65,8.38 C97.1 | C37.1 112.42,14.25 C36.1 | C289.1 VSEN3.6 VSEN3.1 74.15,85.44 arc-90 C286.1 | C27.1 75.84,7.82 C21.1 | v10.67,106.12 12.73,106.12 C265.1
  Top 0.508: 39.82,42.7 C151.1 39.88,42.73 C152.1 42.42,42.58 | 38.35,45.19 C186.1 38.52,46.86 C153.1 | C154.1 44.39,47.41 v44.43,47.37 | C203.1 144.86,28.08 C204.1 C199.1 144.81,31.43 C200.1 | 144.61,31.64 C200.1 | U$42.8 arc-90 28.39,18.5 arc90 28.24,18.35 | 30.77,18.59 arc90 30.77,18.59 | U$56.5 U$56.2 8.26,22.49 C221.1 11.1,22.88 arc90 C215.1 | C372.1 30.94,16.68 28.3,16.68 U$42.8 | 89.95,12.42 C239.1 90.06,14.3 arc-90 C217.1 90.08,16.33 C18.1 | C219.1 90.01,17.86 90.03,17.83 C18.1 | VSEN2.6 44.83,86.94 C279.1 43.86,85.97 C276.1 47.13,86.19 VSEN2.1 | VSEN4.6 98.62,85.69 C174.1 v97.93,82.31 v97.92,82.3 | C286.1 73.76,85.05 | C157.1 8.81,91.23 U$6.7 U$6.8 10.08,89.93 C156.1 11.84,89.69 v12.45,90.3 | C270.1 20.72,87.22 U$21.1 | v18.67,82.93 18.67,85.26 C273.1 19.4,86.04 U$21.1 | C264.1 12.75,104.08 C265.1 | ADJ2.8 37.38,93.5 C52.1 | C55.1 36.07,91.61 ADJ2.7 | C371.1 | U$42.8 28.41,18.7 C373.1 C371.1 | v30.99,22.48 30.99,20.92 C371.1 | 62.89,8.46 C31.2 | C32.2 64.98,8.43 | C262.2 110.52,29.67 C261.2 | C71.1 92.2,89.37 | C305.1 128.51,86.68 VSEN5.1 VSEN5.6 | C302.1 126.33,84.85 C305.1 | 147.7,105.19 C320.1 147.81,103.19 C325.1 | 115.32,70.56 C333.1 | C43.1 R40.2 | C51.1 31.62,90.01 R42.2 | 61.55,88.92 arc90 C45.1 | 88.04,88.86 C54.1 | 90.3,89.09 C72.1 | R56.2 111.64,88.96 C58.1 115.09,89.88 C141.1 116.33,90.05 | ADJ6.7 ADJ6.8 | v76.71,40.89 76.56,41.05 C4.1 | C3.+ 67.83,66.31 C7.1 69.56,66.33 v69.6,66.29 | C15.1 35.04,8.59 C9.1 35.13,8.14 REF5030.2 | v57.79,22.61 59.89,22.61 arc90 C254.2 | v126.11,11.3 126.51,10.9 C40.2 | C200.1 144.71,31.24 146.69,31.24 v146.69,30.73 | 156.07,20.95 R89.1 | v113.28,72.52 115.27,72.52 C336.1
  Top 0.508: C333.1 U$24.7 | U$24.8 115.32,67.18 C333.1 | v131.7,61.72 131.7,64.08 C331.1 | v142.37,66.17 142.19,66.35 C224.1 138.25,66.35 C223.1 | v89.15,64.14 87.36,64.14 R1.1 | C86.1 100.01,84.71 | v101.85,84.71 101.79,84.64 C86.1 | v118.87,105.92 118.87,105.66 C297.1 | VSEN6.6 151.42,86.26 C328.1 149.48,84.22 v149.48,84.33 | v128.4,82.93 128.51,83.05 C305.1 | C198.1 C138.1 41.64,26.56 C209.1 | C18.1 v91.69,16.38 | C202.1 144.71,33.52 C200.1 | v54.61,20.57 54.31,20.28 R79.1 | v35.94,105.28 37.08,106.42 C146.1 | C185.1 44.93,42.42 45.7,43.18 v46.99,43.18 | C261.2 U$58.5 | U$21.6 U$21.1 | 77.49,7.72 C21.1 | R95.1 101.01,7.11 v103.5,7.11 | C69.2 111.76,42.93 v111.76,44.45 | C68.2 111.51,49.19 v111.51,50.55 | C66.2 110.87,61.09 v110.87,62.61 | v111.51,56.52 111.47,56.48 C67.2 | C216.1 5.52,20.78 | 8.37,22.89 C220.1 | C86.1 100.92,85.64 VSEN4.1 | v114.02,13.49 C36.1
  Top 0.61: 112.42,12.47 C36.1
  Top 0.762: v45.85,26.42 45.31,25.88 C139.1 | v42.55,30.1 41.51,29.07 C208.1 | v58.42,8.38 60.69,8.38 arc90 C192.2 | 39.82,42.7 C183.1 | v72.26,83.06 C289.1 | v81.79,7.75 79.7,7.75 C22.1 | 8.65,23.12 C221.1 8.37,22.89 | v3.86,22.45 5.84,22.45 C220.1 5.52,22.13 5.52,20.78
  Top 0.813: 144.83,31.65 C200.1
  Top 1.016: v48.62,85.95 46.93,85.95 C276.1 | C336.1 115.32,70.56 | 145.4,89.53 arc-90 C310.1 | v35.05,9.91 v35.04,9.91 C9.1
  other vias: 2.79,90.42 106.81,29.34 147.7,89.66 89.92,19.81 147.83,32 44.7,45.21 2.79,88.77 39.37,91.19 29.34,89.79 29.34,88.01 38.73,92.71 38.61,108.33 57.66,90.81 57.66,89.15 66.8,91.69 83.69,90.17 83.95,88.52 93.47,91.19 94.61,88.65 111.25,92.08 120.78,90.68 120.9,89.03 119,91.69 136.27,89.15 136.4,91.06 146.56,91.31 47.24,45.09
  pour Mid-Top (rank 3): 0.18,0 172.95,-0.03 172.82,111.2 0.2,111.18
  pour Top: 8.26,91.31 1.4,91.44 1.4,87.88 13.08,87.76 13.08,91.06 10.67,91.06 10.67,94.36 8.26,94.36
  pour Top: 28.45,87 32.51,87 32.51,89.03 40.13,89.03 40.13,94.11 35.43,94.11 35.43,91.57 28.45,91.57
  pour Top: 56.64,88.27 69.21,88.27 69.21,93.34 56.64,93.34
  pour Top: 82.93,87.88 95.38,87.88 95.38,93.47 82.93,93.47
  pour Top: 110.24,87.88 121.67,87.88 121.67,93.6 110.24,93.6
  pour Top: 135.38,88.27 148.46,88.27 148.46,93.85 135.38,93.85
  pour Top: 35.81,48.13 35.81,42.04 48.64,42.16 48.64,48.26
3V3_FTDI  (via drill 0.51)
  Top 0.305: 19.62,73.15 C87.1
  Top 0.356: C87.1 18.73,72.26 U1.4 | U1.17 13.53,65.86 v15.88,68.2 | v17.91,73.15 19.62,73.15
  Bottom 0.356: v15.88,68.2 15.88,71.12 v17.91,73.15
5V_AUX
  Top 0.406: C42.2 17.07,43.91 U3.6
  pour Top: 1.4,29.97 16.76,29.84 16.89,45.72 1.4,45.85
5V_USB
  Top 0.406: R67.2 18.36,48.39 U3.8
  pour Top: 1.65,48.13 22.1,48.01 22.22,54.74 30.99,54.74 31.11,74.68 1.78,74.8
!RST  (via drill 0.25)
  Top 0.203: J9.10 79.5,69.42 79.5,72.14 80.91,73.55 S3.S1 92.06,73.55 92.2,73.41 92.2,69.84 R6.1 | MSP432.83 71.37,57.11 v71.37,57.28
  Top 0.508: C13.1 88.32,68.29 R6.1
  Bottom 0.203: J9.10 71.37,60.1 v71.37,57.28
-2V5
  Top 0.508: C244.1 15.98,22.62 U$57.5 16.43,24.36 C243.1 | C177.1 24.41,24.74 U$42.4
  pour Top: 25.65,28.19 25.7,22.17 15.04,22.17 14.99,28.19
-3V3_NOISY
  Top 0.508: C237.1 18.63,18.84 16.28,18.84 C241.1 16.11,18.84 13.91,18.84 C242.1 C240.1 12.04,18.94 | U$57.2 U$57.3
  pour Top: 10.29,17.53 17.53,17.53 17.65,19.68 14.86,19.68 14.86,21.46 9.02,21.46 9.02,18.92
-OUT2  (via drill 0.38)
  Top 0.254: U$41.1 U$41.2 31.7,25.35 40.01,33.66 v46.23,33.66
  Top 0.508: U$41.1 28.3,24.19 U$42.1 28.3,26.29 C49.2
  Bottom 0.254: v46.23,33.66 162.05,33.66 162.81,32.89 J1.41
-OUT4  (via drill 0.38)
  Top 0.254: C50.2 27.31,15.82 U$45.8 U$45.7 29.95,13.18 v31.5,14.73
  Top 0.508: C50.2 U$42.7
  Bottom 0.254: v31.5,14.73 31.5,20.57 38.99,28.07 38.99,29.08 42.8,32.89 160.53,32.89 161.8,31.62 164.21,31.62 J1.42
A0
  Top 0.152: TP22.TP 14.14,86.06 C266.1
  Top 0.254: TP22.TP 18.73,76.71 62.87,76.71 71.93,67.64 MSP432.69 71.91,62.43
  Top 0.508: C266.1 12.79,88.1 R41.1
A1
  Top 0.254: R2.2 24.5,95.2 TP21.TP 28.33,77.34 62.99,77.34 72.43,67.91 MSP432.68 72.41,62.42
A2
  Top 0.254: R45.1 C147.1 39.3,86.73 TP24.TP 42.35,78.23 62.87,78.23 72.93,68.17 MSP432.67 72.9,62.44
A3
  Top 0.254: R54.2 51.45,82.15 TP23.TP 52.61,78.99 62.87,78.99 73.43,68.43 MSP432.66 73.41,62.43
A4
  Top 0.254: C282.1 67.17,82.24 TP26.TP 66.67,81.97 66.67,75.95 73.93,68.69 MSP432.65 73.91,62.43
  Top 0.305: R53.1 68.18,86.05 C282.1
A5
  Top 0.254: R60.1 78.72,92.11 TP25.TP 74.43,77.45 MSP432.64 74.4,62.41
A6
  Top 0.254: R52.1 91.54,83.85 C82.1 | TP28.TP 80.77,81.41 74.93,75.56 MSP432.63 74.91,62.41
  Top 0.508: R52.1 91.56,81.7 TP28.TP
A7
  Top 0.254: R128.1 104.39,80.95 TP27.TP 101.4,80.95 99.31,78.87 79.38,78.87 75.43,74.92 MSP432.62 75.41,62.41
A8
  Top 0.254: R59.1 122.44,85.83 C298.1 122.44,82.93 TP30.TP 124.48,80.77 107.44,80.77 104.52,77.85 79.76,77.85 75.93,74.03 MSP432.61 75.89,62.41
A12
  Top 0.254: R69.1 134.04,90.28 TP29.TP 132.61,79.25 107.95,79.25 105.41,76.71 80.64,76.71 77.93,73.99 MSP432.57 77.9,62.44
A13
  Top 0.254: C321.1 147.83,83.84 TP32.TP 142.47,78.49 108.46,78.49 105.92,75.95 80.9,75.95 78.43,73.48 MSP432.56 78.41,62.43
  Top 0.508: R65.1 148.11,84.5 C321.1
A14
  Top 0.254: 159.83,91.33 R71.2 159.87,82.17 TP31.TP 157.41,79.72 155.29,77.6 108.71,77.6 106.3,75.18 81.28,75.18 78.93,72.83 MSP432.55 78.89,62.45
A15  (via drill 0.25, 0.51)
  Top 0.203: v93.09,65.15 79.43,65.15 MSP432.54
  Top 0.254: v109.85,64.64 111.84,64.72 R72.1
  Mid-Top 0.203: v99.57,62.87 95.38,62.87 v93.09,65.15
  Bottom 0.203: v99.57,62.87 100.08,61.98 100.2,61.85 107.06,61.85 v109.85,64.64
A20  (via drill 0.25, 0.38)
  Top 0.203: v75.56,57.78 77.93,60.15 82.69,60.15 arc-90 MSP432.49 | 55.63,35.56 55.63,17.53 TP3.TP 57.02,16.38 R28.1
  Top 0.254: R28.1 63.35,16.38 C176.1 | 55.63,35.56 56.39,36.32 v77.34,36.32
  Bottom 0.203: v75.56,57.78 75.56,52.45 77.72,50.29 77.72,36.7 v77.34,36.32
A21  (via drill 0.25, 0.38)
  Top 0.203: v76.45,57.02 76.45,57.78 78.31,59.64 82.7,59.64 arc-90 MSP432.48 | v61.09,35.05 59.43,33.4 TP11.TP
  Top 0.254: v61.09,35.05 v78.74,35.05 | C137.1 62,31.48 R27.1
  Top 0.305: 59.16,31.75 R27.1 58.9,33.32 TP11.TP
  Bottom 0.203: v76.45,57.02 76.45,52.7 78.74,50.42 v78.74,35.05
A22  (via drill 0.25)
  Top 0.203: v77.47,57.78 78.82,59.13 82.71,59.13 arc-90 MSP432.47 | C136.1 133.96,27.93 TP14.TP 133.96,33.81 132.33,35.43 v91.06,35.43
  Top 0.406: C136.1 arc-90 132.78,26.66 R83.1
  Bottom 0.203: v77.47,57.78 77.47,52.83 79.63,50.67 79.63,45.97 90.17,35.43 v91.06,35.43
A23  (via drill 0.25)
  Top 0.203: v78.61,57.66 79.58,58.62 82.72,58.62 arc-90 MSP432.46 | TP9.TP 136.4,18.41 136.4,34.42 134.62,36.2 v93.85,36.2
  Top 0.406: C179.1 133.86,8.89 R37.1
  Top 0.457: 137.03,8.95 137.03,12.95 TP9.TP
  Top 0.508: C179.1 137.03,8.95
  Bottom 0.203: v78.61,57.66 78.61,53.09 80.52,51.18 80.52,48.51 92.84,36.2 v93.85,36.2
ADC_REF+
  Top 0.254: C367.1 49.53,67.31 50.18,67.96 C73.1 C74.1 C30.1 69.71,67.96 71.43,66.24 MSP432.70 71.4,62.44
  Top 0.508: REF5040.6 39.44,58.28 C366.1 C367.1
AVCC
  Top 0.254: C2.1 65.15,51.18 65.41,51.44 65.41,54.61 65.91,55.11 MSP432.87 | MSP432.45 83.51,58.11 83.95,58.55 83.95,62.13 84.23,62.41 C1.1
  Top 0.305: MSP432.45 80.33,58.11 77.34,55.12 MSP432.87
  Top 0.508: C1.1 85.66,62.13 R1.2
DCOR
  Top 0.203: R5.1 84.45,59.56 84.45,58.29 83.77,57.61 MSP432.44
EN1  (via drill 0.25)
  Top 0.203: v62.48,62.87 63.75,61.59 65.41,61.59 66.39,60.61 MSP432.76
  Top 0.254: U$6.6 7.54,91.55 R40.1 4.05,92.2 v1.91,92.2
  Bottom 0.203: v62.48,62.87 49.28,62.87 40.39,71.75 30.71,71.75 24.99,77.47 10.92,77.47 6.6,81.79 4.19,81.79 1.91,84.07 v1.91,92.2
EN2  (via drill 0.25)
  Top 0.203: 69.39,60.76 v69.34,60.71 | v26.54,90.68 27.58,91.71 R42.1
  Top 0.254: R42.1 34.8,91.71 ADJ2.6 | MSP432.74 69.43,60.79 v69.34,60.71
  Mid-Top 0.203: v56.39,72.52 52.32,72.52 v52.07,72.77
  Bottom 0.203: v69.34,60.71 68.96,60.71 57.15,72.52 v56.39,72.52 | v52.07,72.77 48.77,76.07 32.26,76.07 26.54,81.79 v26.54,90.68
EN3  (via drill 0.25)
  Top 0.203: 76.91,72.19 v76.71,72.39 76.93,72.17 MSP432.59 | v56.01,92.08 57.98,92.08 R46.1
  Top 0.254: R46.1 62.61,90.62 ADJ3.6
  Bottom 0.203: v76.71,72.39 69.09,80.01 64.13,80.01 56.01,88.14 v56.01,92.08
EN4  (via drill 0.25)
  Top 0.203: v81.91,91.19 85.17,91.19 R49.1 | 77.39,62.41 MSP432.58 77.43,74.51 v80.01,77.09
  Top 0.254: R49.1 86.57,89.79 89.03,89.79 89.66,90.42 ADJ4.6
  Bottom 0.203: v80.01,77.09 81.91,78.99 v81.91,91.19
EN5  (via drill 0.25)
  Top 0.203: v109.47,86.87 109.47,88.49 R56.1 | MSP432.52 80.43,60.87 v80.39,60.83
  Top 0.254: R56.1 111.45,90.55 114.43,90.55 115.06,91.19 ADJ5.6
  Bottom 0.203: v109.47,86.87 109.47,85.98 94.74,71.25 91.44,71.25 88.14,67.94 84.96,67.94 80.39,63.37 v80.39,60.83
EN6  (via drill 0.25)
  Top 0.203: v136.91,85.09 134.75,87.25 134.75,92.2 137.04,92.2 R62.1 | v82.17,64.01 80.93,62.77 MSP432.51
  Top 0.254: R62.1 138.49,90.42 142.49,90.42 ADJ6.6
  Bottom 0.203: v136.91,85.09 129.54,77.72 102.23,77.72 94.87,70.36 91.57,70.36 88.52,67.31 85.47,67.31 v82.17,64.01
EN7  (via drill 0.25)
  Top 0.203: v117.47,72.39 117.47,73.03 R70.1 | v83.44,63.25 81.41,61.21 81.41,60.63 82.71,60.63 MSP432.50
  Top 0.254: R70.1 116.46,73.74 116.46,70.23 116.97,69.72 U$24.6
  Mid-Top 0.203: v94.23,69.34 v99.57,69.34
  Bottom 0.203: v117.47,72.39 114.43,69.34 109.6,69.34 108.97,69.98 100.2,69.98 v99.57,69.34 | v83.44,63.25 86.11,63.25 91.19,68.33 93.22,68.33 v94.23,69.34
GND  (via drill 0.25, 0.3, 0.33, 0.38, 0.5, 0.51, 0.6, 0.76, 0.8, 1)
  Top 0.152: S3.S2 S3.G2 | U$7.GND 4.95,52.61 4.95,52.58 4.7,52.58
  Top 0.203: v65.53,47.37 65.43,47.47 LED1.C | v96.27,74.17 95.64,73.55 S3.S2 | v115.19,43.94 114.58,44.66
  Top 0.254: 14.2,63.98 U1.18 14.22,64.02 | C149.2 34.77,52.32 v35.59,53.14 | v145.29,22.61 146.27,23.59 U$11.6 | U$11.1 147.7,26.84 v147.7,28.25 | U$12.1 46.69,23.16 v46.69,24.64 | 50.81,21.84 U$12.12 | U$14.1 95.27,13.36 95.27,14.61 v95.33,14.61 | U$4.4 U$4.3 | v65.15,10.92 64.95,10.49 U$18.2 | C25.2 112.58,21.82 U$58.2 | C34.2 114.5,6.07 U$19.2 | U$17.2 77.8,13.44 C20.2 arc-90 76.83,14.41 v76.83,15.88 | R98.2 112.43,93.89 ADJ5.5 | R101.2 141.22,93 ADJ6.5 | R102.2 120.05,72.99 U$24.5 | v2.92,76.2 LED6.C | v2.92,66.42 3.05,66.55 LED2.C | U$14.12 arc-90 98.67,12.06 | v82.68,31.75 82.68,30.09 arc90 R99.2 | v78.61,16.13 80.21,16.13 arc-90 R13.2 | U$4.2 U$4.3 | U$4.3 U$4.8 4.75,104.22 v4.32,104.65 | v29.72,104.01 29.84,104.14 POT2.8 POT2.3 POT2.4 | v63.75,103.63 64.13,104 POT3.4 POT3.3 POT3.2 | v95.12,102.62 96.71,102.62 C56.2 | POT4.3 POT4.4 90.8,104.13 v90.8,105.79 | POT5.8 115.7,103.76 v116.08,103.38 116.08,103.26 POT5.2 POT5.3 POT5.4 | U$59.2 126.24,24.55 126.24,23.11 v125.35,22.23 | MSP432.84 67.13,56.64 65.79,56.64 65.79,57.61 MSP432.82 68.66,57.61 v68.96,57.91 | v75.95,48.64 75.93,48.62 MSP432.15 | v115.19,55.37 114.33,56.23 U$23.GND 114.33,56.86 R138.2 | v115.7,39.12 114.71,39.12 U$9.GND | R106.2 114.58,44.66 U$10.GND | v114.3,62.74 114.21,62.83 R139.2 | R107.2 114.46,50.89 | 114.46,50.89 U$22.GND | v115.19,50.16 114.46,50.89
  Top 0.305: U$20.2 127,8.39 v125.86,7.24 124.94,6.33 R31.1 | C248.2 80.05,29.95 U$15.2 | U$14.6 88.85,10.11 v88.27,9.53 | C217.2 88.18,14.17 v86.38,12.37 | R74.2 17.07,53.81 U3.3 | R78.2 16.78,72.56 U1.7 | v25.78,34.8 25.91,34.92 LED5.C | U1.25 U1.26 19.38,62.36 C89.2 | 14.22,64.02 14.22,64.9 14.73,65.41 15.75,65.41 16.13,65.02 U1.21 | ESD_DIODE.4 13.25,59.09 13.84,59.09 | U$13.4 136.01,68.15 C223.2 | v138.3,69.98 138.15,69.98 C223.2 | C224.2 138.25,68.25 C223.2 | v156.59,25.4 156.45,25.54 U$11.12 | 98.67,12.06 102.74,12.06 v103.5,12.83 | v128.14,65.15 129.04,65.15 U$31.2 | C331.2 133.6,64.08 133.6,69.09 v132.33,70.1 132.31,70.1 C330.2 130.04,68.53 U$31.4 | v51.44,53.59 51.46,53.59 S1.G1 | v55.25,46.23 S1.S2 53.3,44.96 S1.G2 | v24.77,39.24 24.89,39.37 C189.2 | v26.92,39.24 26.95,39.27 C190.2 | v31.62,39.12 31.65,39.14 C180.2 | v29.08,38.99 29.03,38.99 C178.2 | v13.84,61.98 14.18,61.98 U1.18 | ADJ5.5 113.79,95 ADJ5.9 | POT6.4 POT6.3 POT6.8 137.92,103.76 v137.29,103.12 | U$42.3 25.76,28.68 v26.29,29.21 | v54.1,21.84 54.09,21.86 U$12.12 | 75.95,46.81 MSP432.15 | MSP432.40 80.9,55.61 v80.9,56.26 80.9,57.11 MSP432.43 | MSP432.71 70.93,63.94 v70.23,64.64 | v70.74,60.71 70.43,61.02 MSP432.72 | v109.22,62.61 109.26,62.61 C66.1 | C284.1 69.69,91.57 v68.58,91.57 | C285.2 76.01,91.31 v77.6,91.31
  Top 0.33: v31.88,47.37 31.88,46.07 U$43.6 34.52,46.07 U$43.EXP | v33.78,39.75 34.04,39.75 C193.2
  Top 0.381: v86.38,17.5 86.77,17.88 C219.2
  Top 0.406: v77.72,19.33 77.75,19.33 77.75,21.58 C249.2 77.59,21.53 C251.2 | v21.39,88.14 19.44,88.14 U$21.2 | C261.1 108.62,29.52 arc-90 C262.1 arc-90 108.71,29.78 v108.71,31.75 | v125.35,22.23 125.37,22.23 R26.2 123.7,20.11 C259.2 | C263.1 132.65,28.49 arc-90 C136.2 132.74,30.08 arc90 v132.72,30.1 | v124.71,26.8 arc90 v124.72,26.79 C258.2 | v124.71,28.96 arc90 v124.72,28.95 C26.2 | v112.78,32.13 arc90 v112.77,32.13 C257.2 | v108.33,12.45 110.52,12.06 C36.2 | U$16.2 65.01,25.26 66.55,26.8 66.55,28.7 | 66.55,28.7 C253.2 | v66.55,30.86 66.55,28.7 | v13.84,61.98 13.84,59.09 C91.2 | C14.2 39.63,5.6 REF5030.4 | v78.33,31.75 C248.2 | v65.91,32 65.52,32 C137.2 | v12.57,23.88 U$57.1 | v34.29,20.83 32.69,20.83 C371.2 | v38.99,13.59 39.09,13.59 R93.1 | v41.58,13.95 41.58,15.96 C210.2 | C4.2 73.11,41.67 C8.2 | C275.2 49.16,92.59 v49.15,94.11 | C274.1 40.67,92.55 v40.51,92.71 | C85.2 103.07,92.63 v102.87,92.84 | C84.1 95.44,90.99 v94.87,90.42 | C301.2 131.26,91.37 v132.21,90.42 | C300.1 123.28,90.77 v122.28,91.77 | C324.2 157.12,90.69 v157.12,92.25 | C323.1 149.73,91.7 v149.73,91.82 | 40.05,95.07 arc90 C59.2 | C57.2 v41.4,93.85 | C27.2 C21.2
  Top 0.508: C152.2 42.51,41.03 | C153.2 40.16,51.51 | 40.16,51.51 v39.8,51.87 | C154.2 42.47,49.2 40.16,51.51 | v42.55,45.39 40.45,45.39 C186.2 | C99.2 C98.2 48.67,9.66 v48.67,10.49 | C203.2 C204.2 C199.2 142.81,29.96 C200.2 142.91,31.64 C202.2 | C211.2 v43.79,13.61 | C212.2 v46.13,13.64 | v34.95,18.77 arc-90 34.85,18.67 34.82,18.7 C373.2 32.84,16.88 C372.2 | v5.87,17.4 6.48,18.01 U$56.4 | v14.12,27.94 14.12,26.17 C244.2 | v16.28,28.02 16.28,26.14 C243.2 | C239.2 86.38,12.32 v86.38,12.37 | v70.46,31.04 70.58,31.04 R18.1 | v79.68,19.68 79.68,21.4 C250.2 | VSEN2.2 48.29,88.92 v49.2,88.01 | v43.82,82.3 43.82,83.96 C279.2 | v46.94,82.32 46.94,84.24 C276.2 | 96.01,85.02 C174.2 v96.03,82.31 v96.01,82.3 | v99.97,81.74 99.97,83.32 C86.2 | v102.56,87.86 102.56,87.89 VSEN4.2 | v90.5,86.21 90.52,86.21 C72.2 | v92.71,86.06 92.68,86.06 C71.2 | v94.87,90.42 94.38,91.44 C76.2 | v98.68,106.45 98.6,106.37 C81.2 | v122.28,91.77 122.28,93.42 C294.2 | v157.1,87.22 155.15,87.22 VSEN6.2 | v148.06,91.49 147.42,93.29 C315.2 | v149.73,91.82 149.73,93.44 C317.2 | v76.86,85.14 75.52,85.14 C286.2 | v75.95,88.11 VSEN3.2 | v18.57,14.68 18.57,17.01 C237.2 | C242.2 13.81,14.86 v13.72,14.86 | v11.51,14.99 11.51,17.04 C240.2 | C184.2 41.66,56.95 v43.61,56.95 | v39.24,62.38 arc-90 39.44,62.19 C366.2 | v10.41,85.34 10.32,85.34 C156.2 | v7.37,85.98 7.48,85.98 C157.2 | R73.2 3.79,94.36 v3.68,94.36 4.9,93.15 U$6.5 6.27,95.86 U$6.9 | C162.2 14.39,94.7 C159.2 12.19,94.61 v12.19,92.46 13.91,92.46 C268.1 | v17.02,105.92 16.83,106.11 C265.2 14.37,105.83 C264.2 14.41,103.95 | C19.2 14.54,101.98 v16.89,101.98 | v29.59,92.84 29.59,93.64 R84.2 32.3,94.78 ADJ2.5 33.53,96.01 ADJ2.9